# EasyEDA schematic SCH_AIO v4 Std 2024-02-05.json

## Sheets
1 MAIN: TITLE: Sheet_1; REV: 1.0; Date: 2023-03-03; Sheet: 1/1; Drawn By: Richard Klasens; Company: Your Company
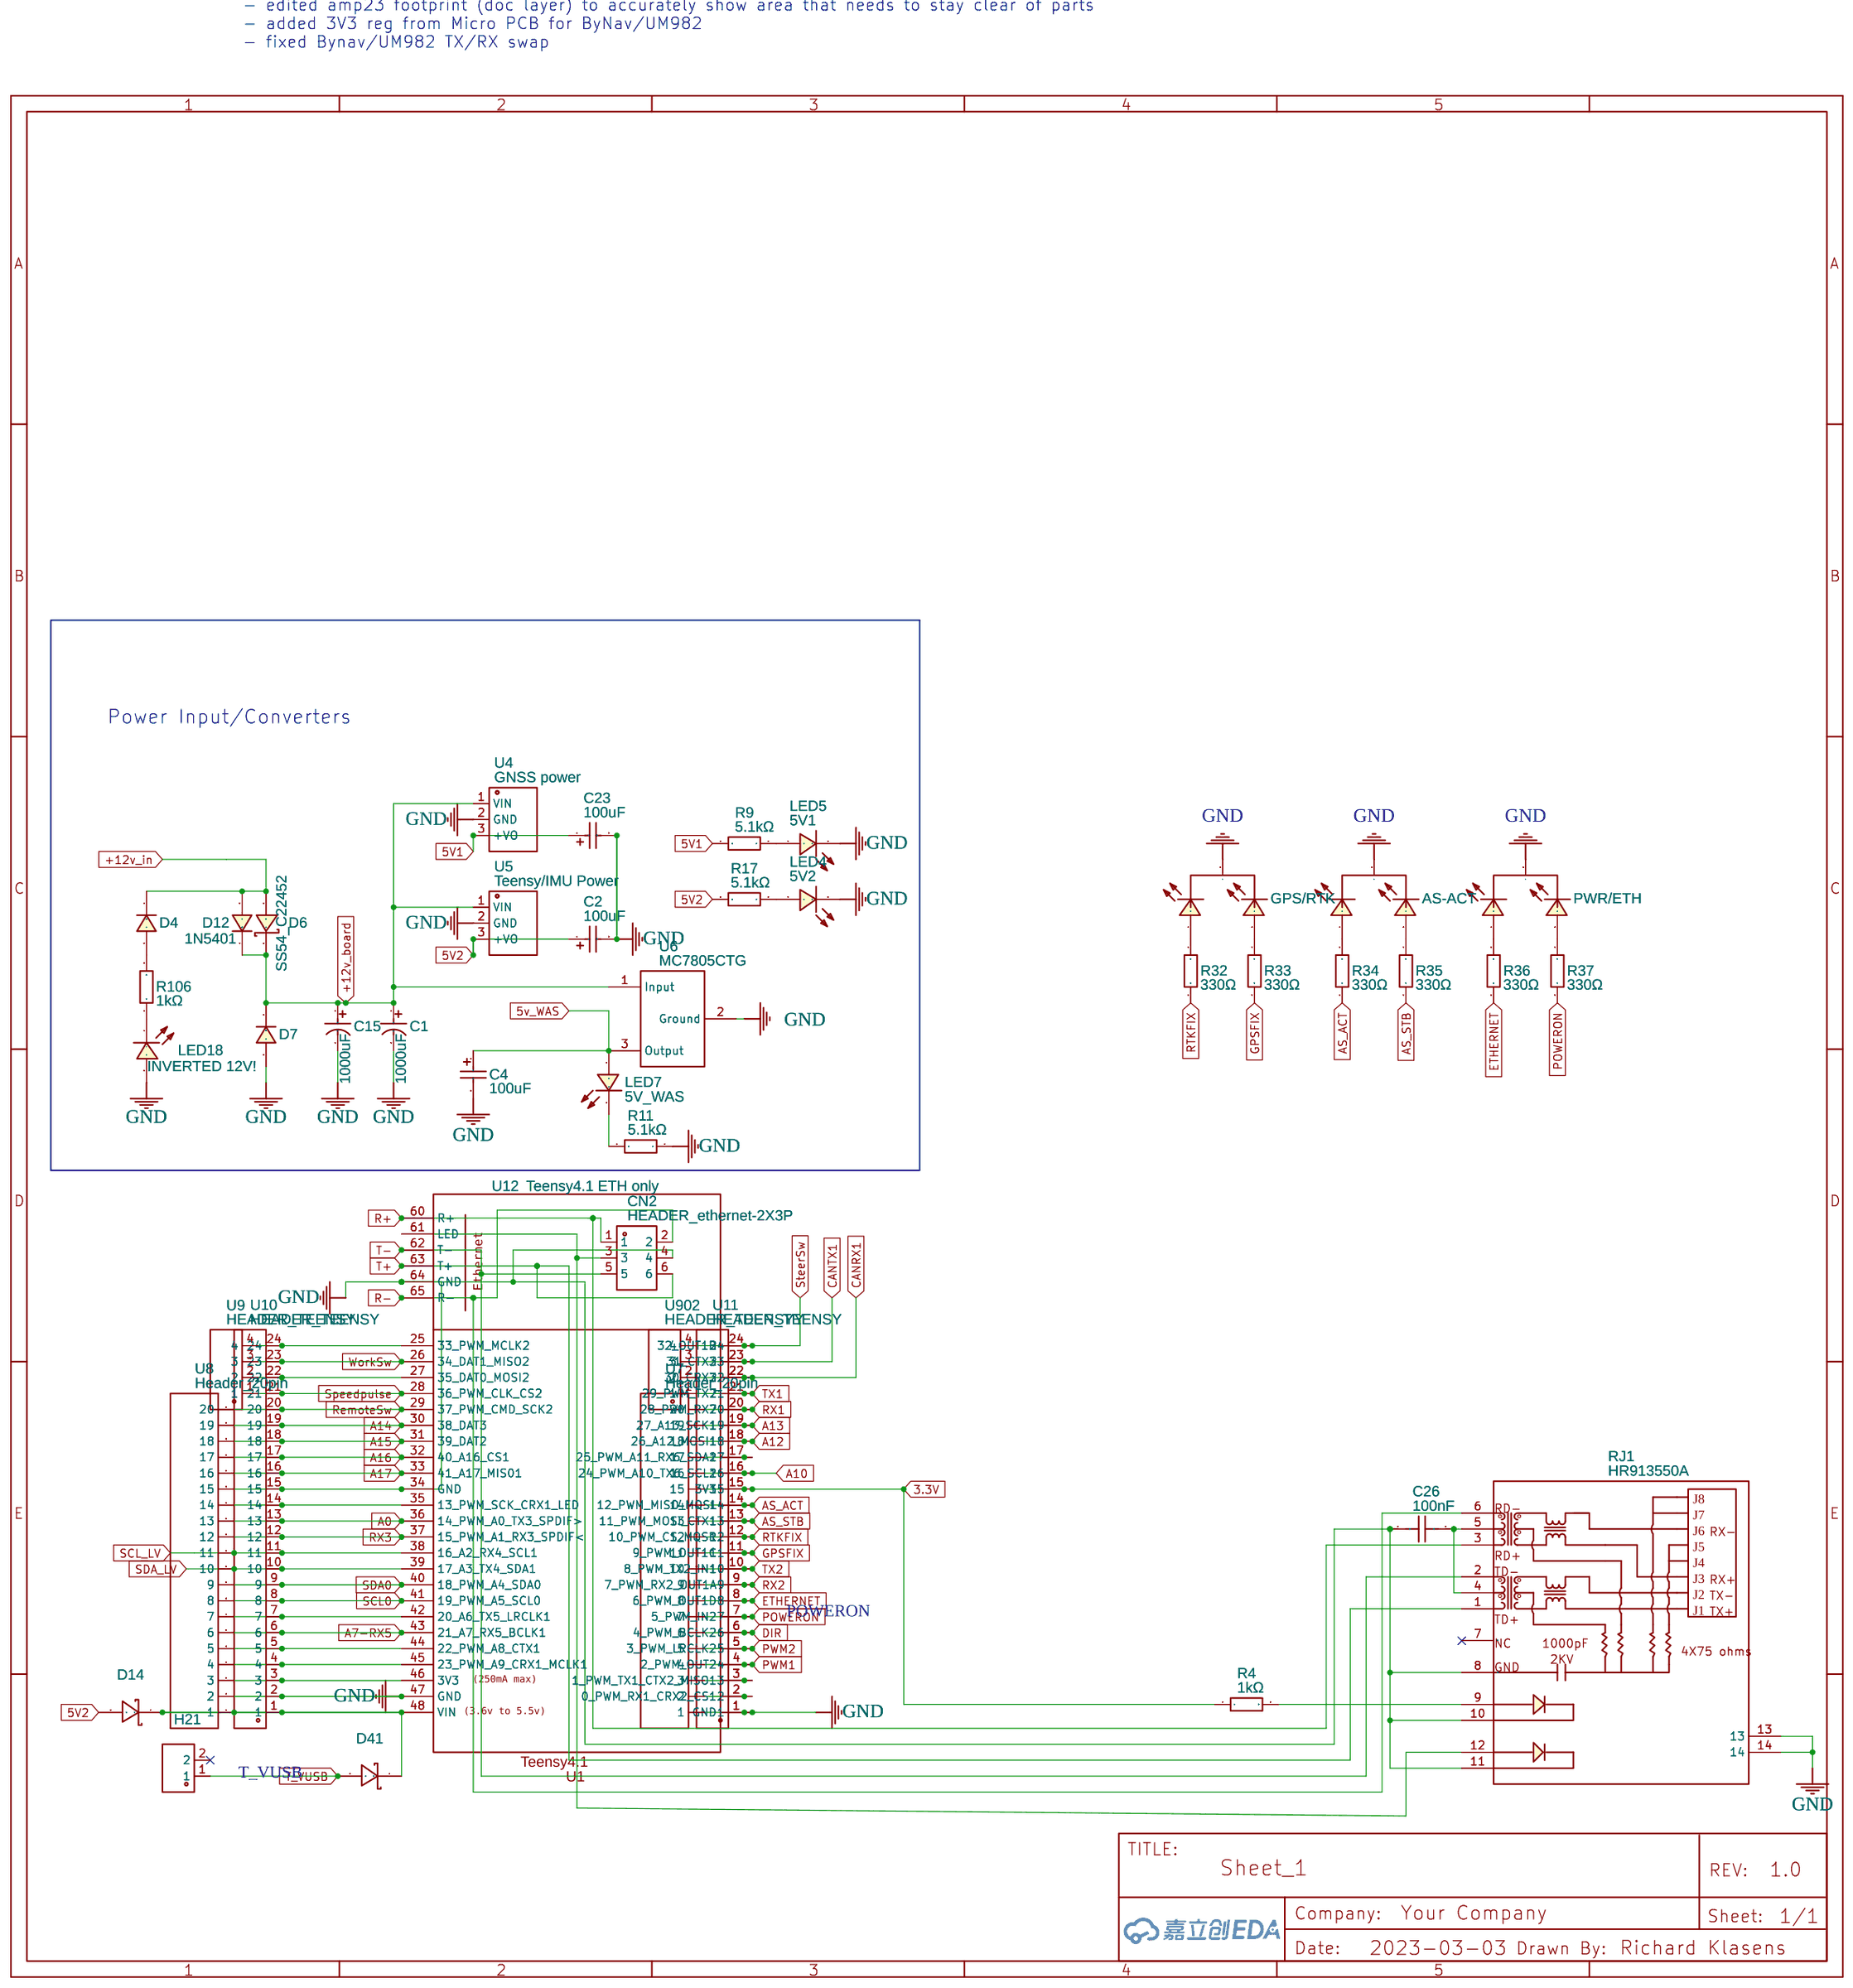
[diagram p0: MAIN]
2 WAS
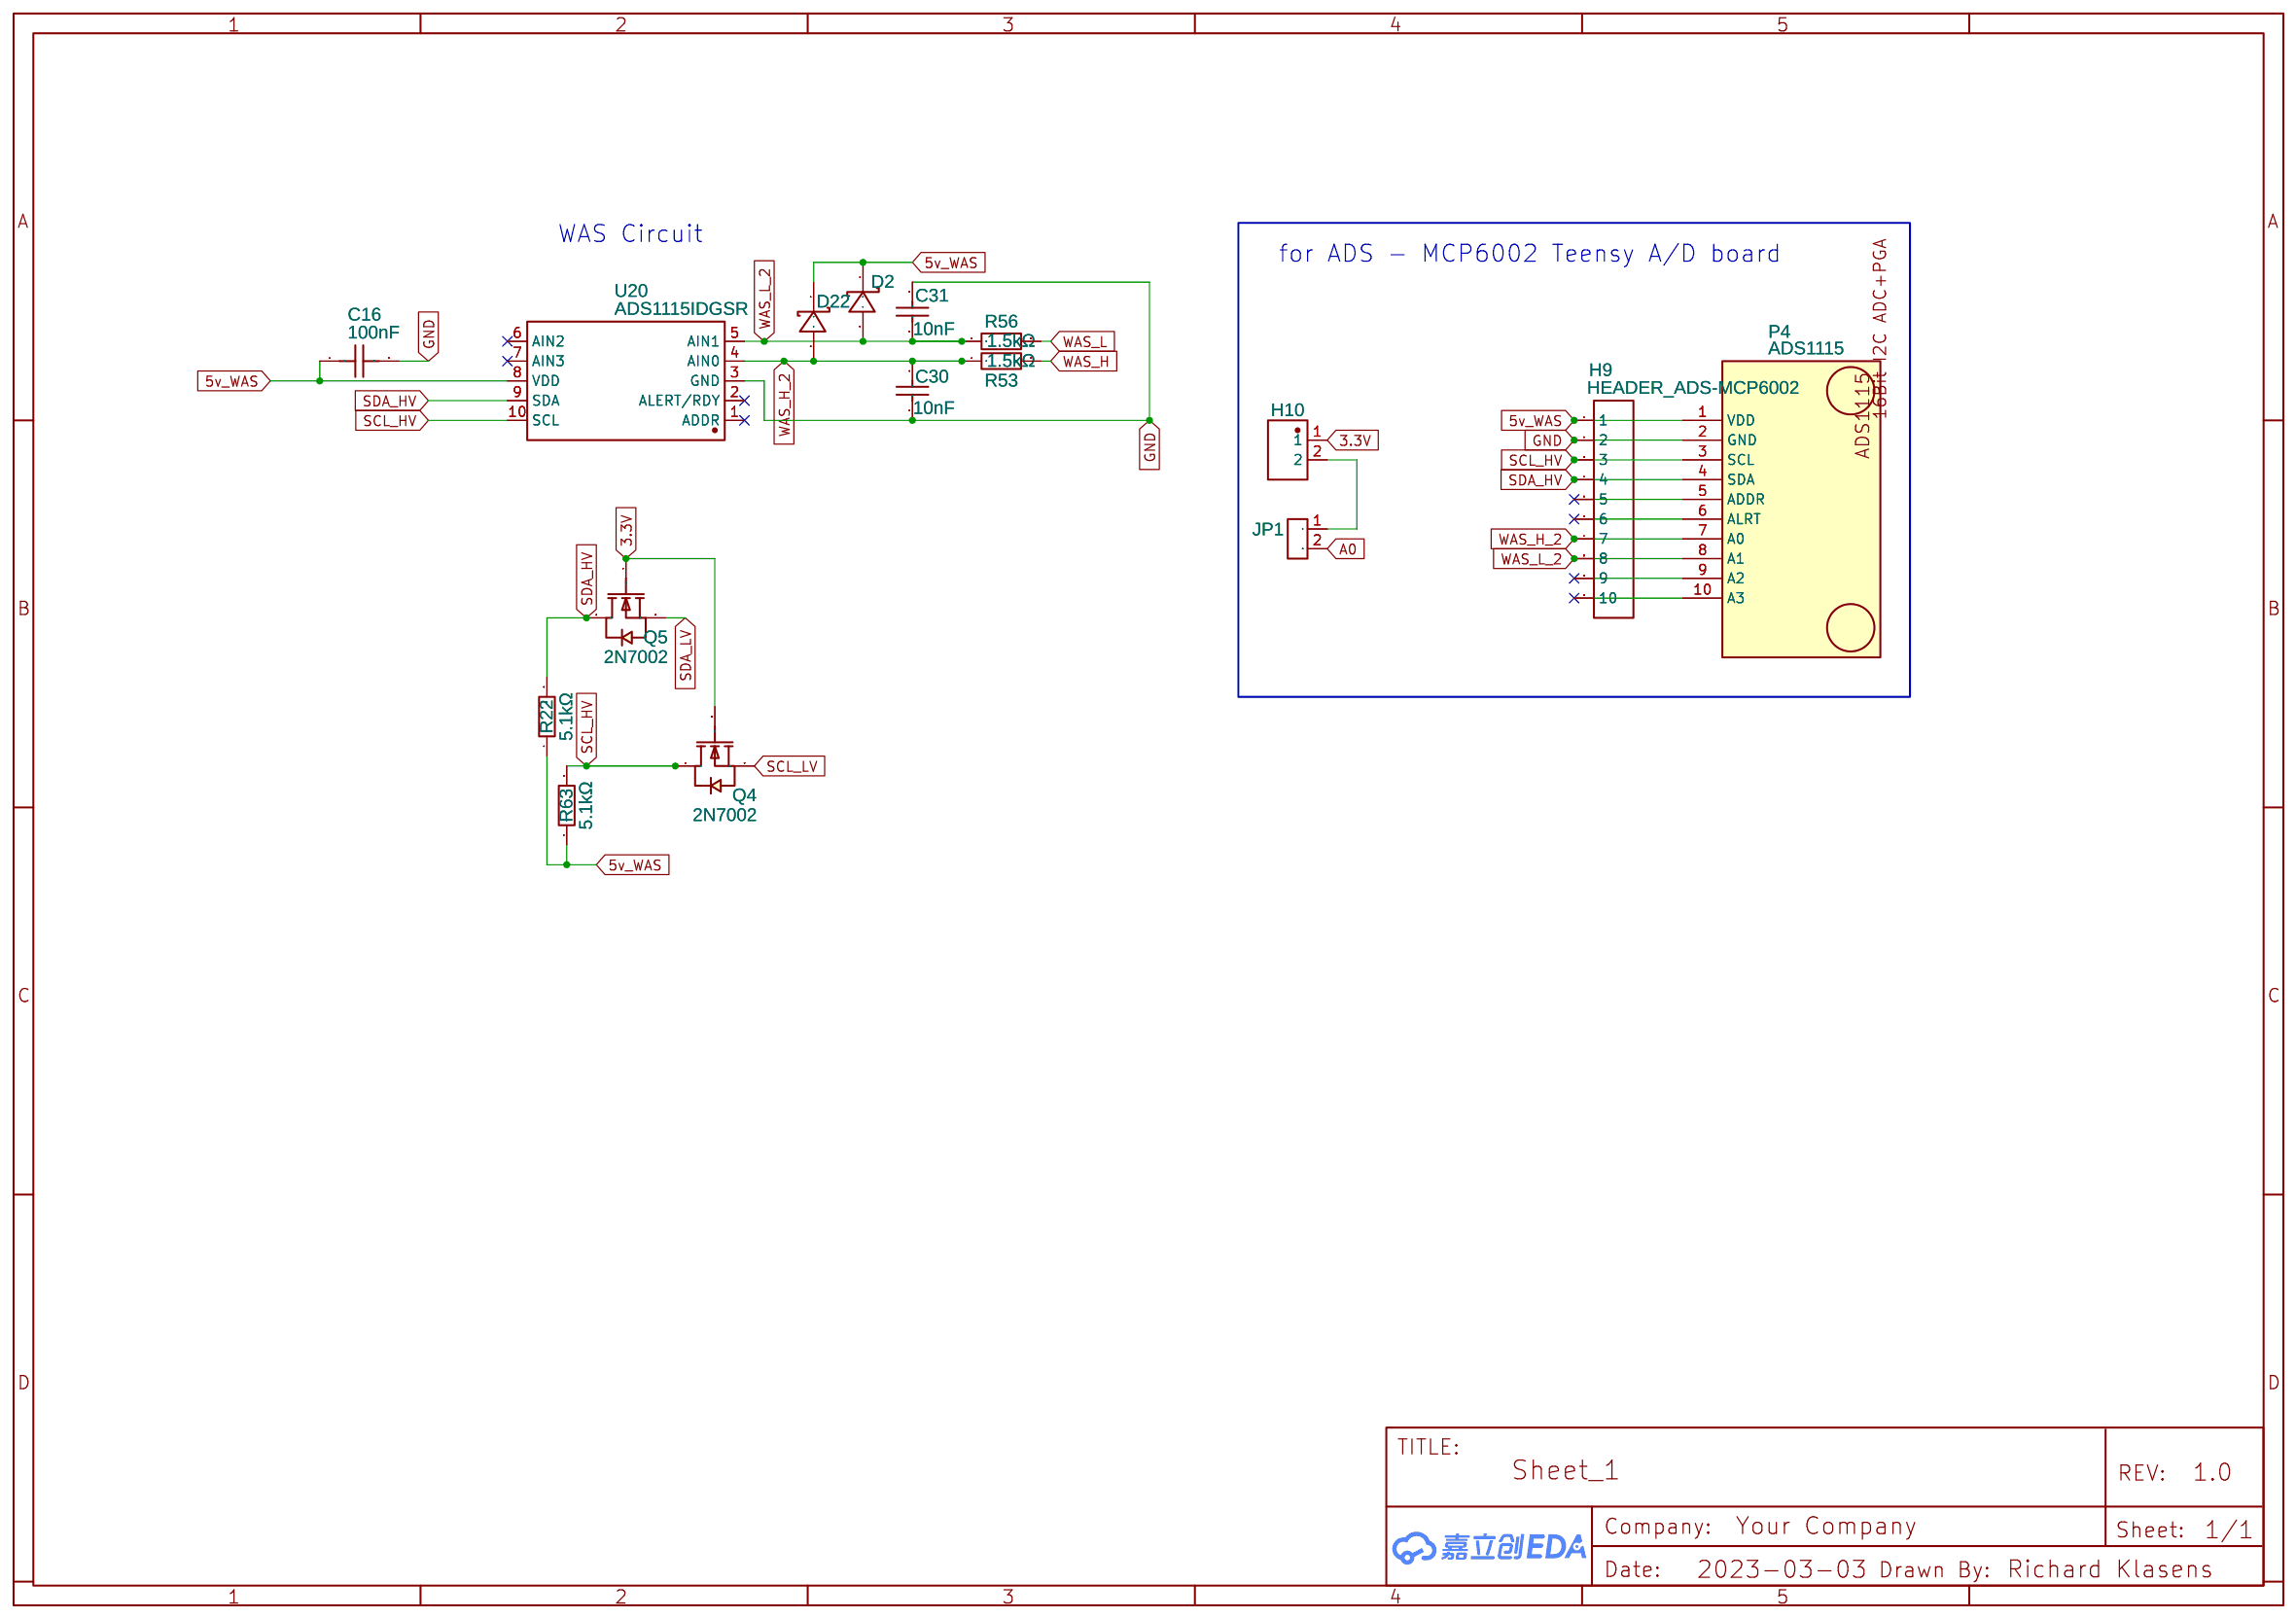
[diagram p1: WAS]
3 STEERING
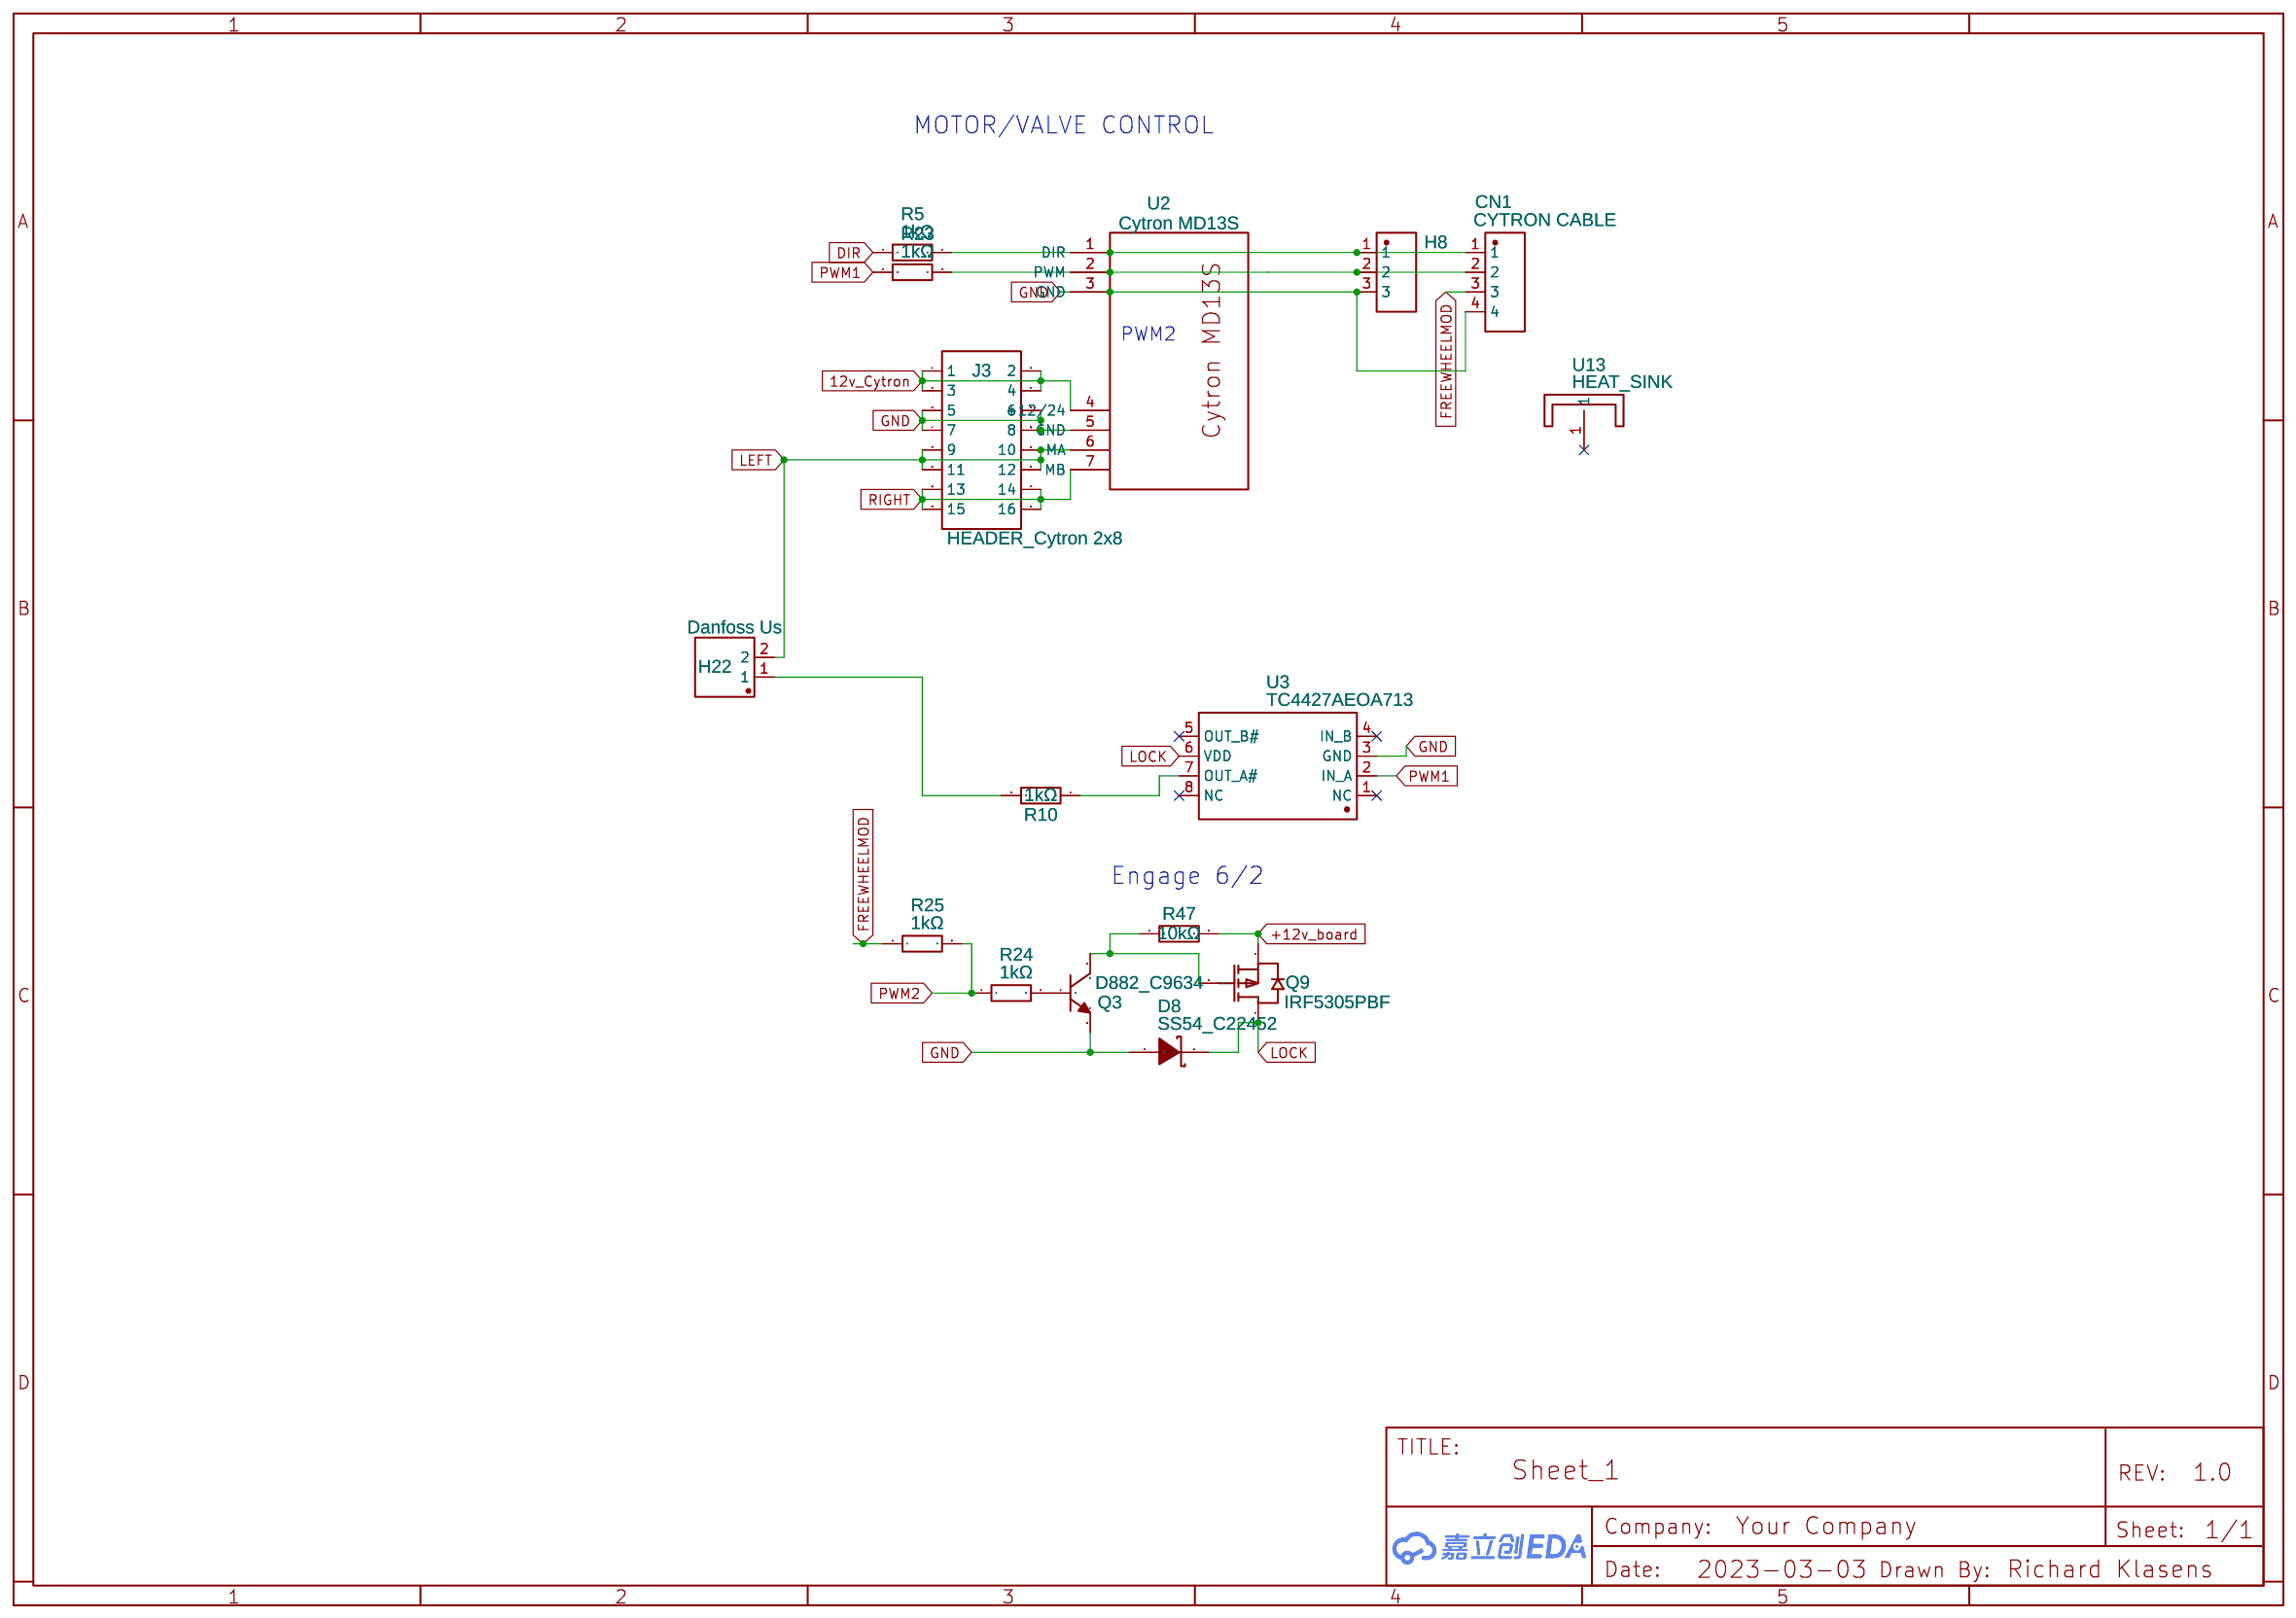
[diagram p2: STEERING]
4 IMU
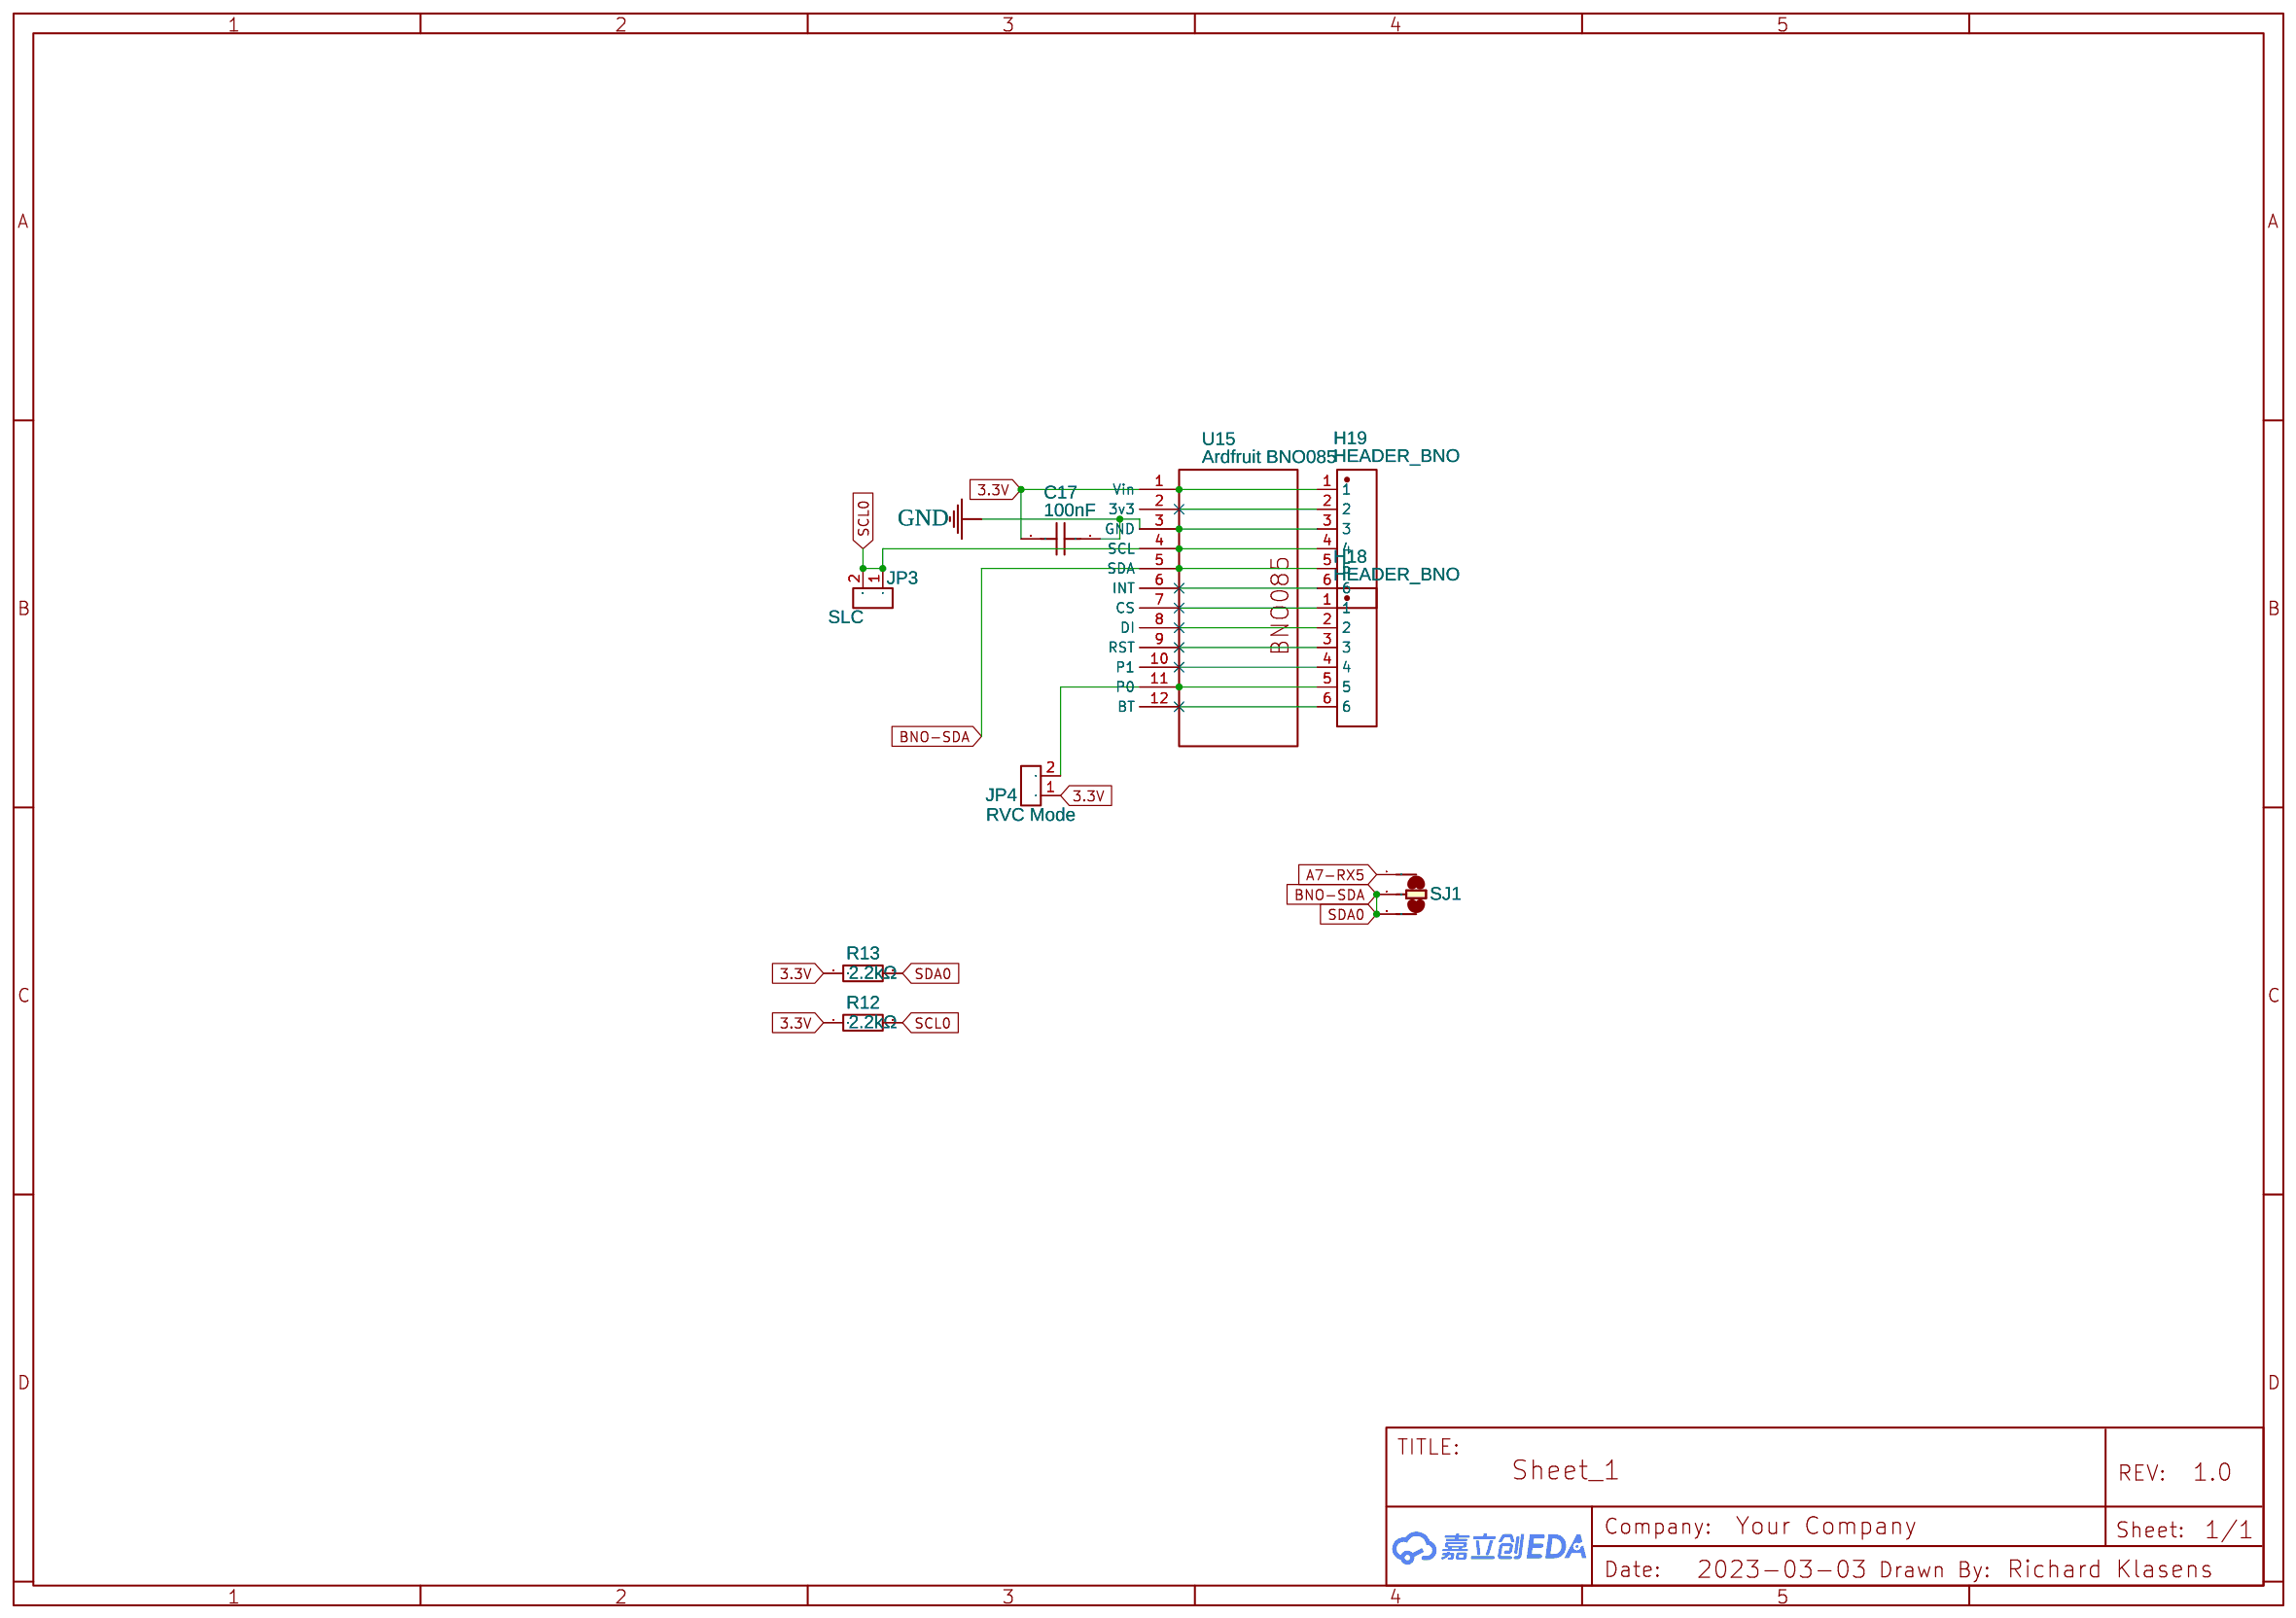
[diagram p3: IMU]
5 GPS
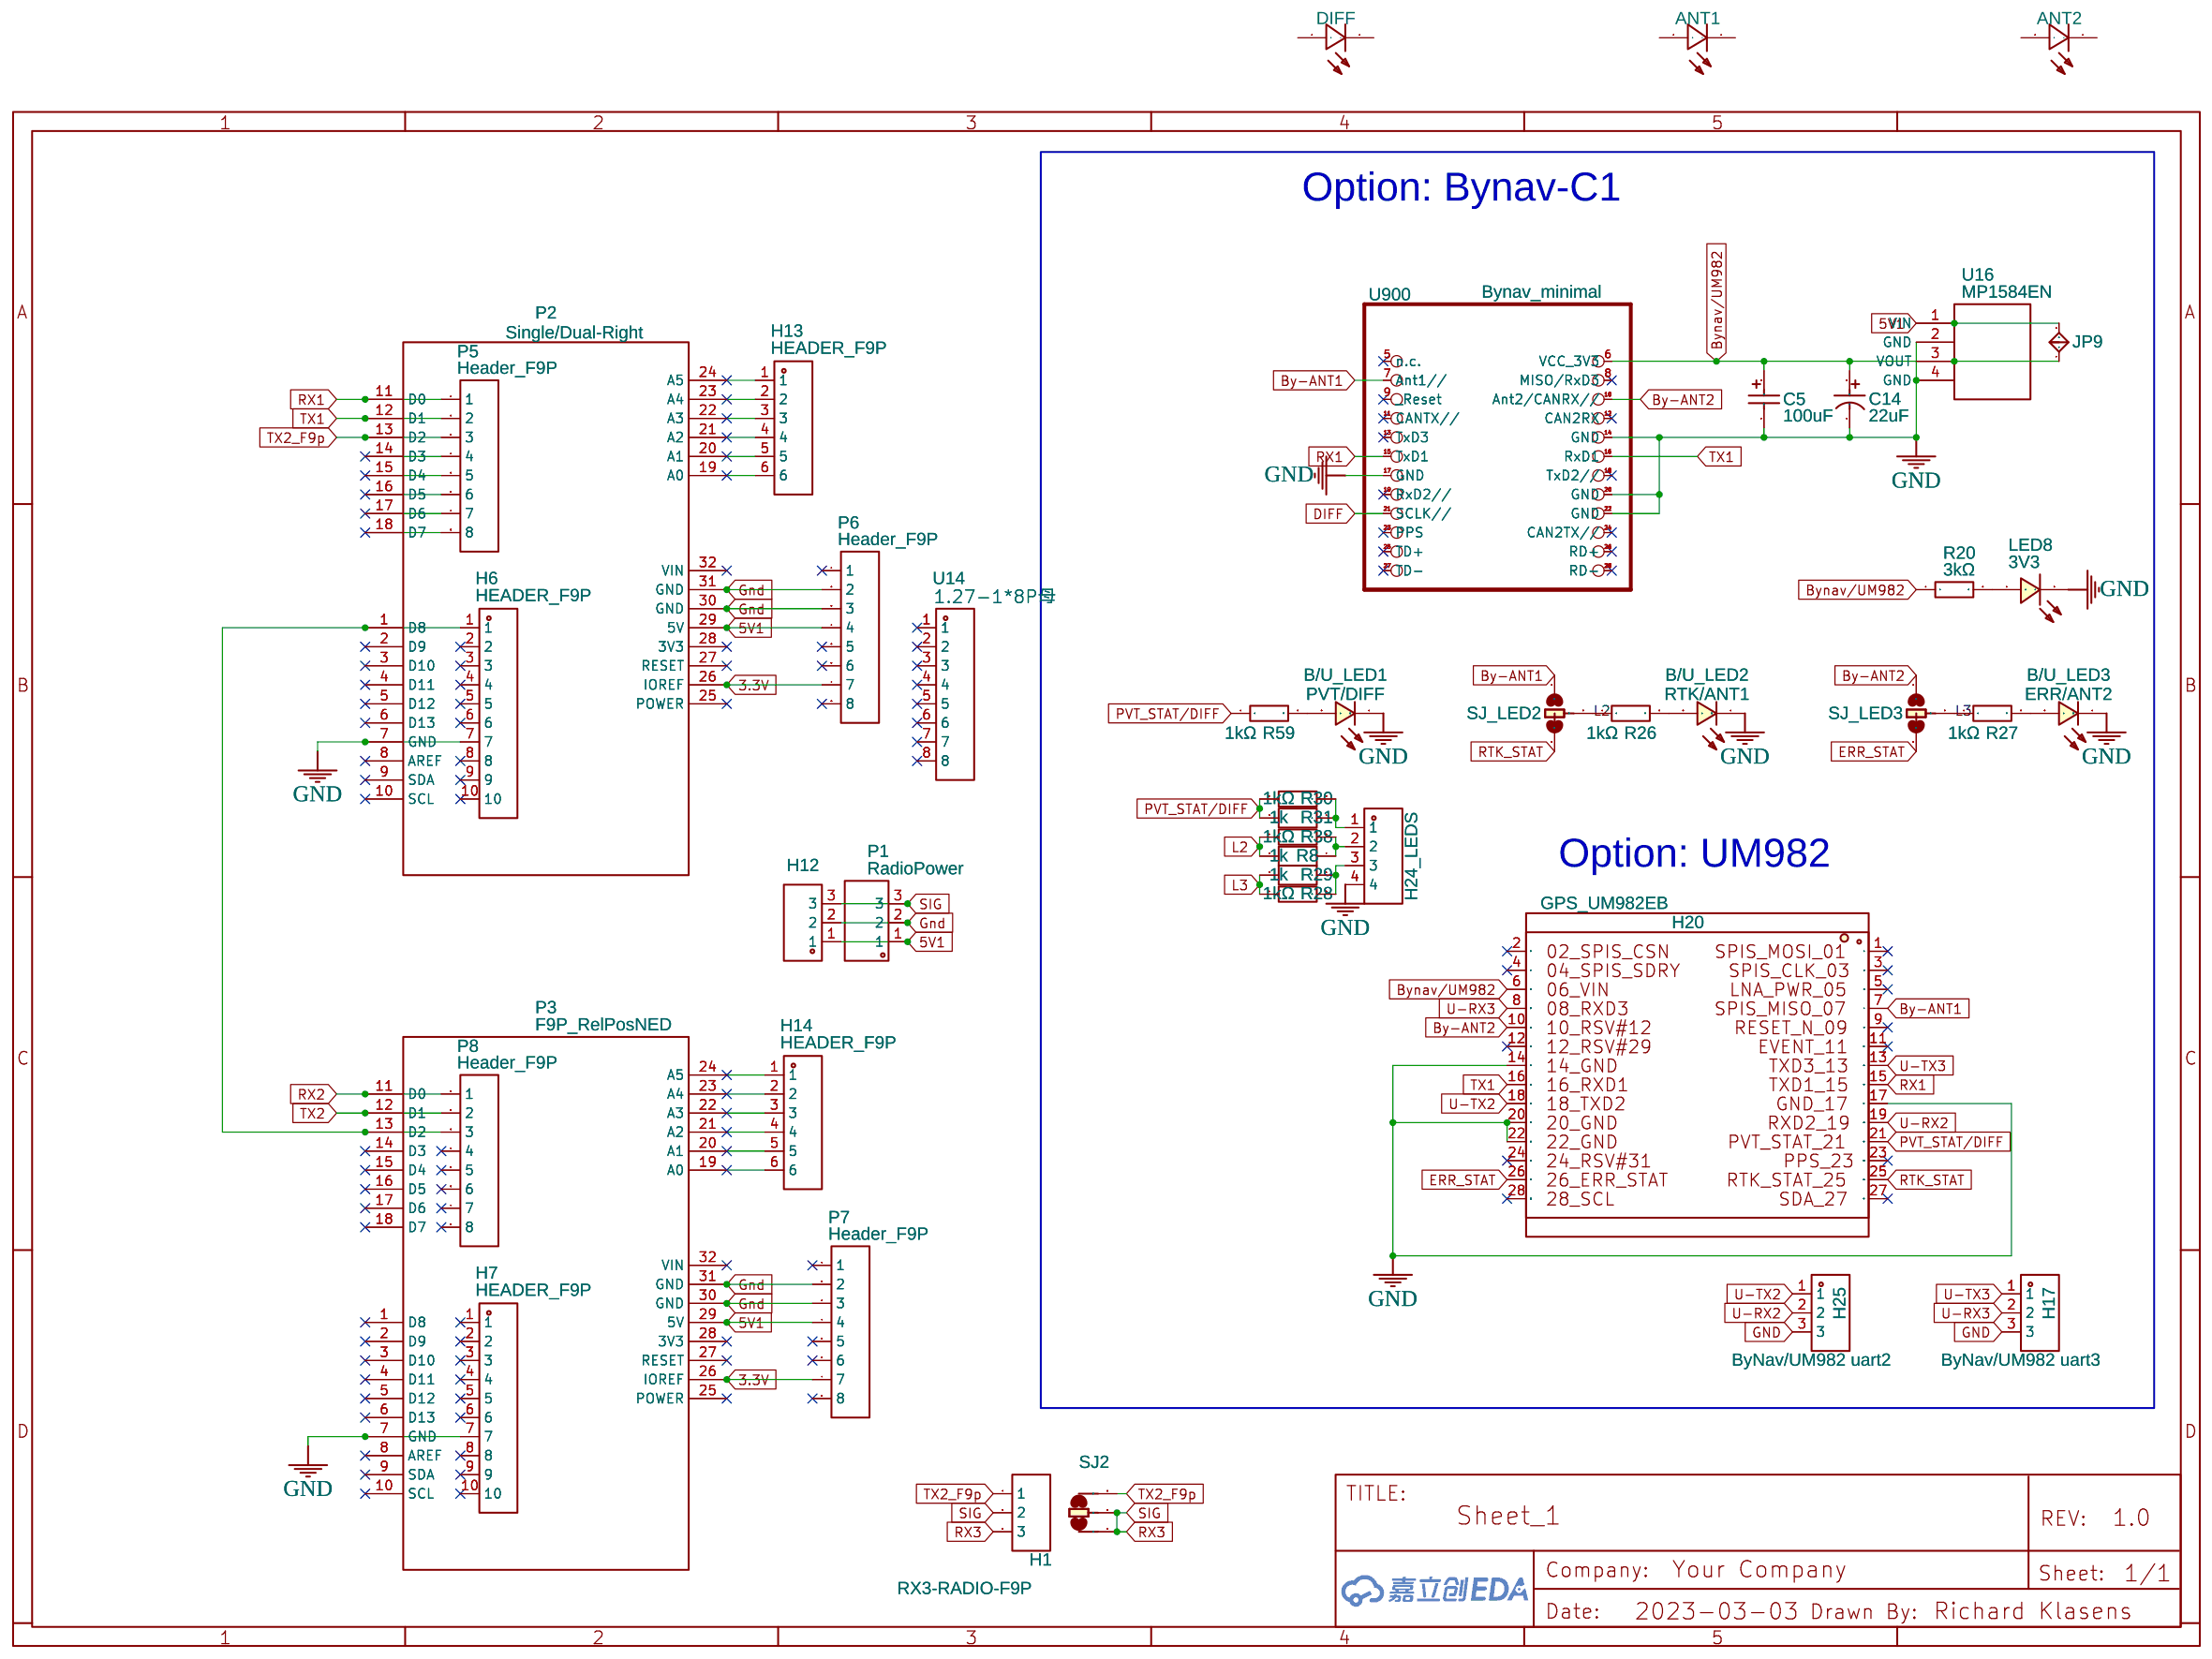
[diagram p4: GPS]
6 INPUTS: TITLE: INPUTS
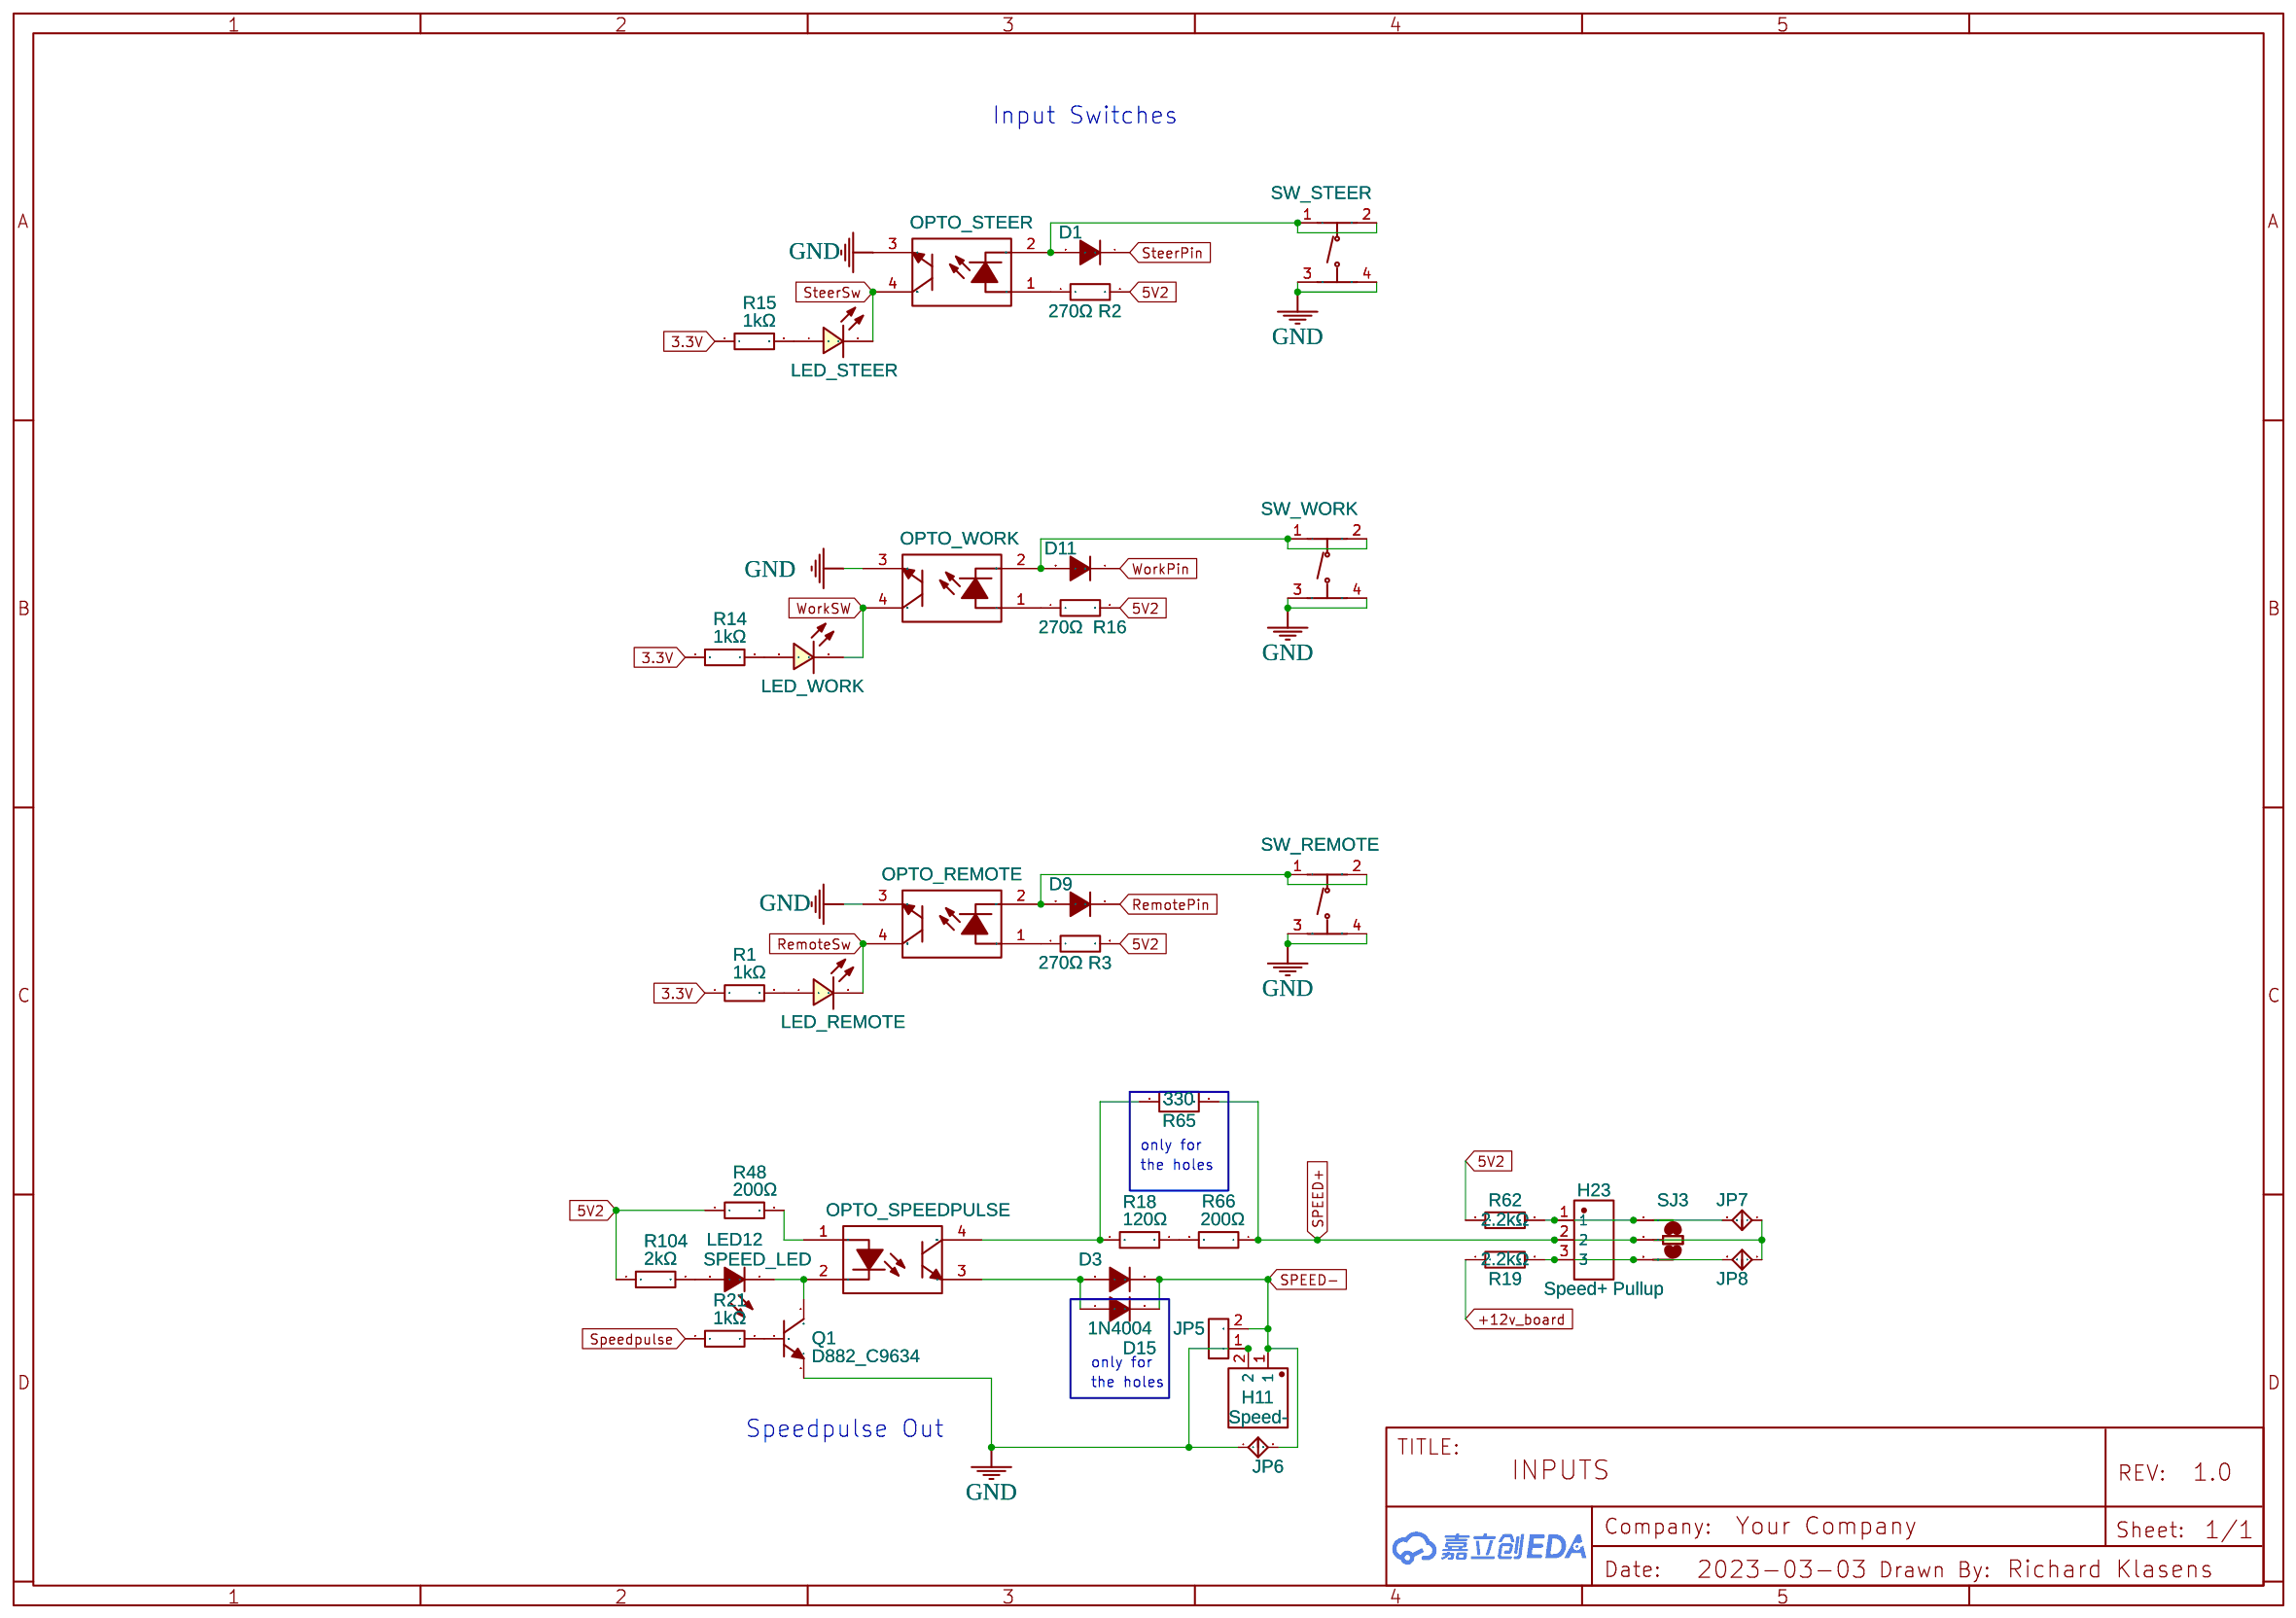
[diagram p5: INPUTS]
7 CONNECTORS
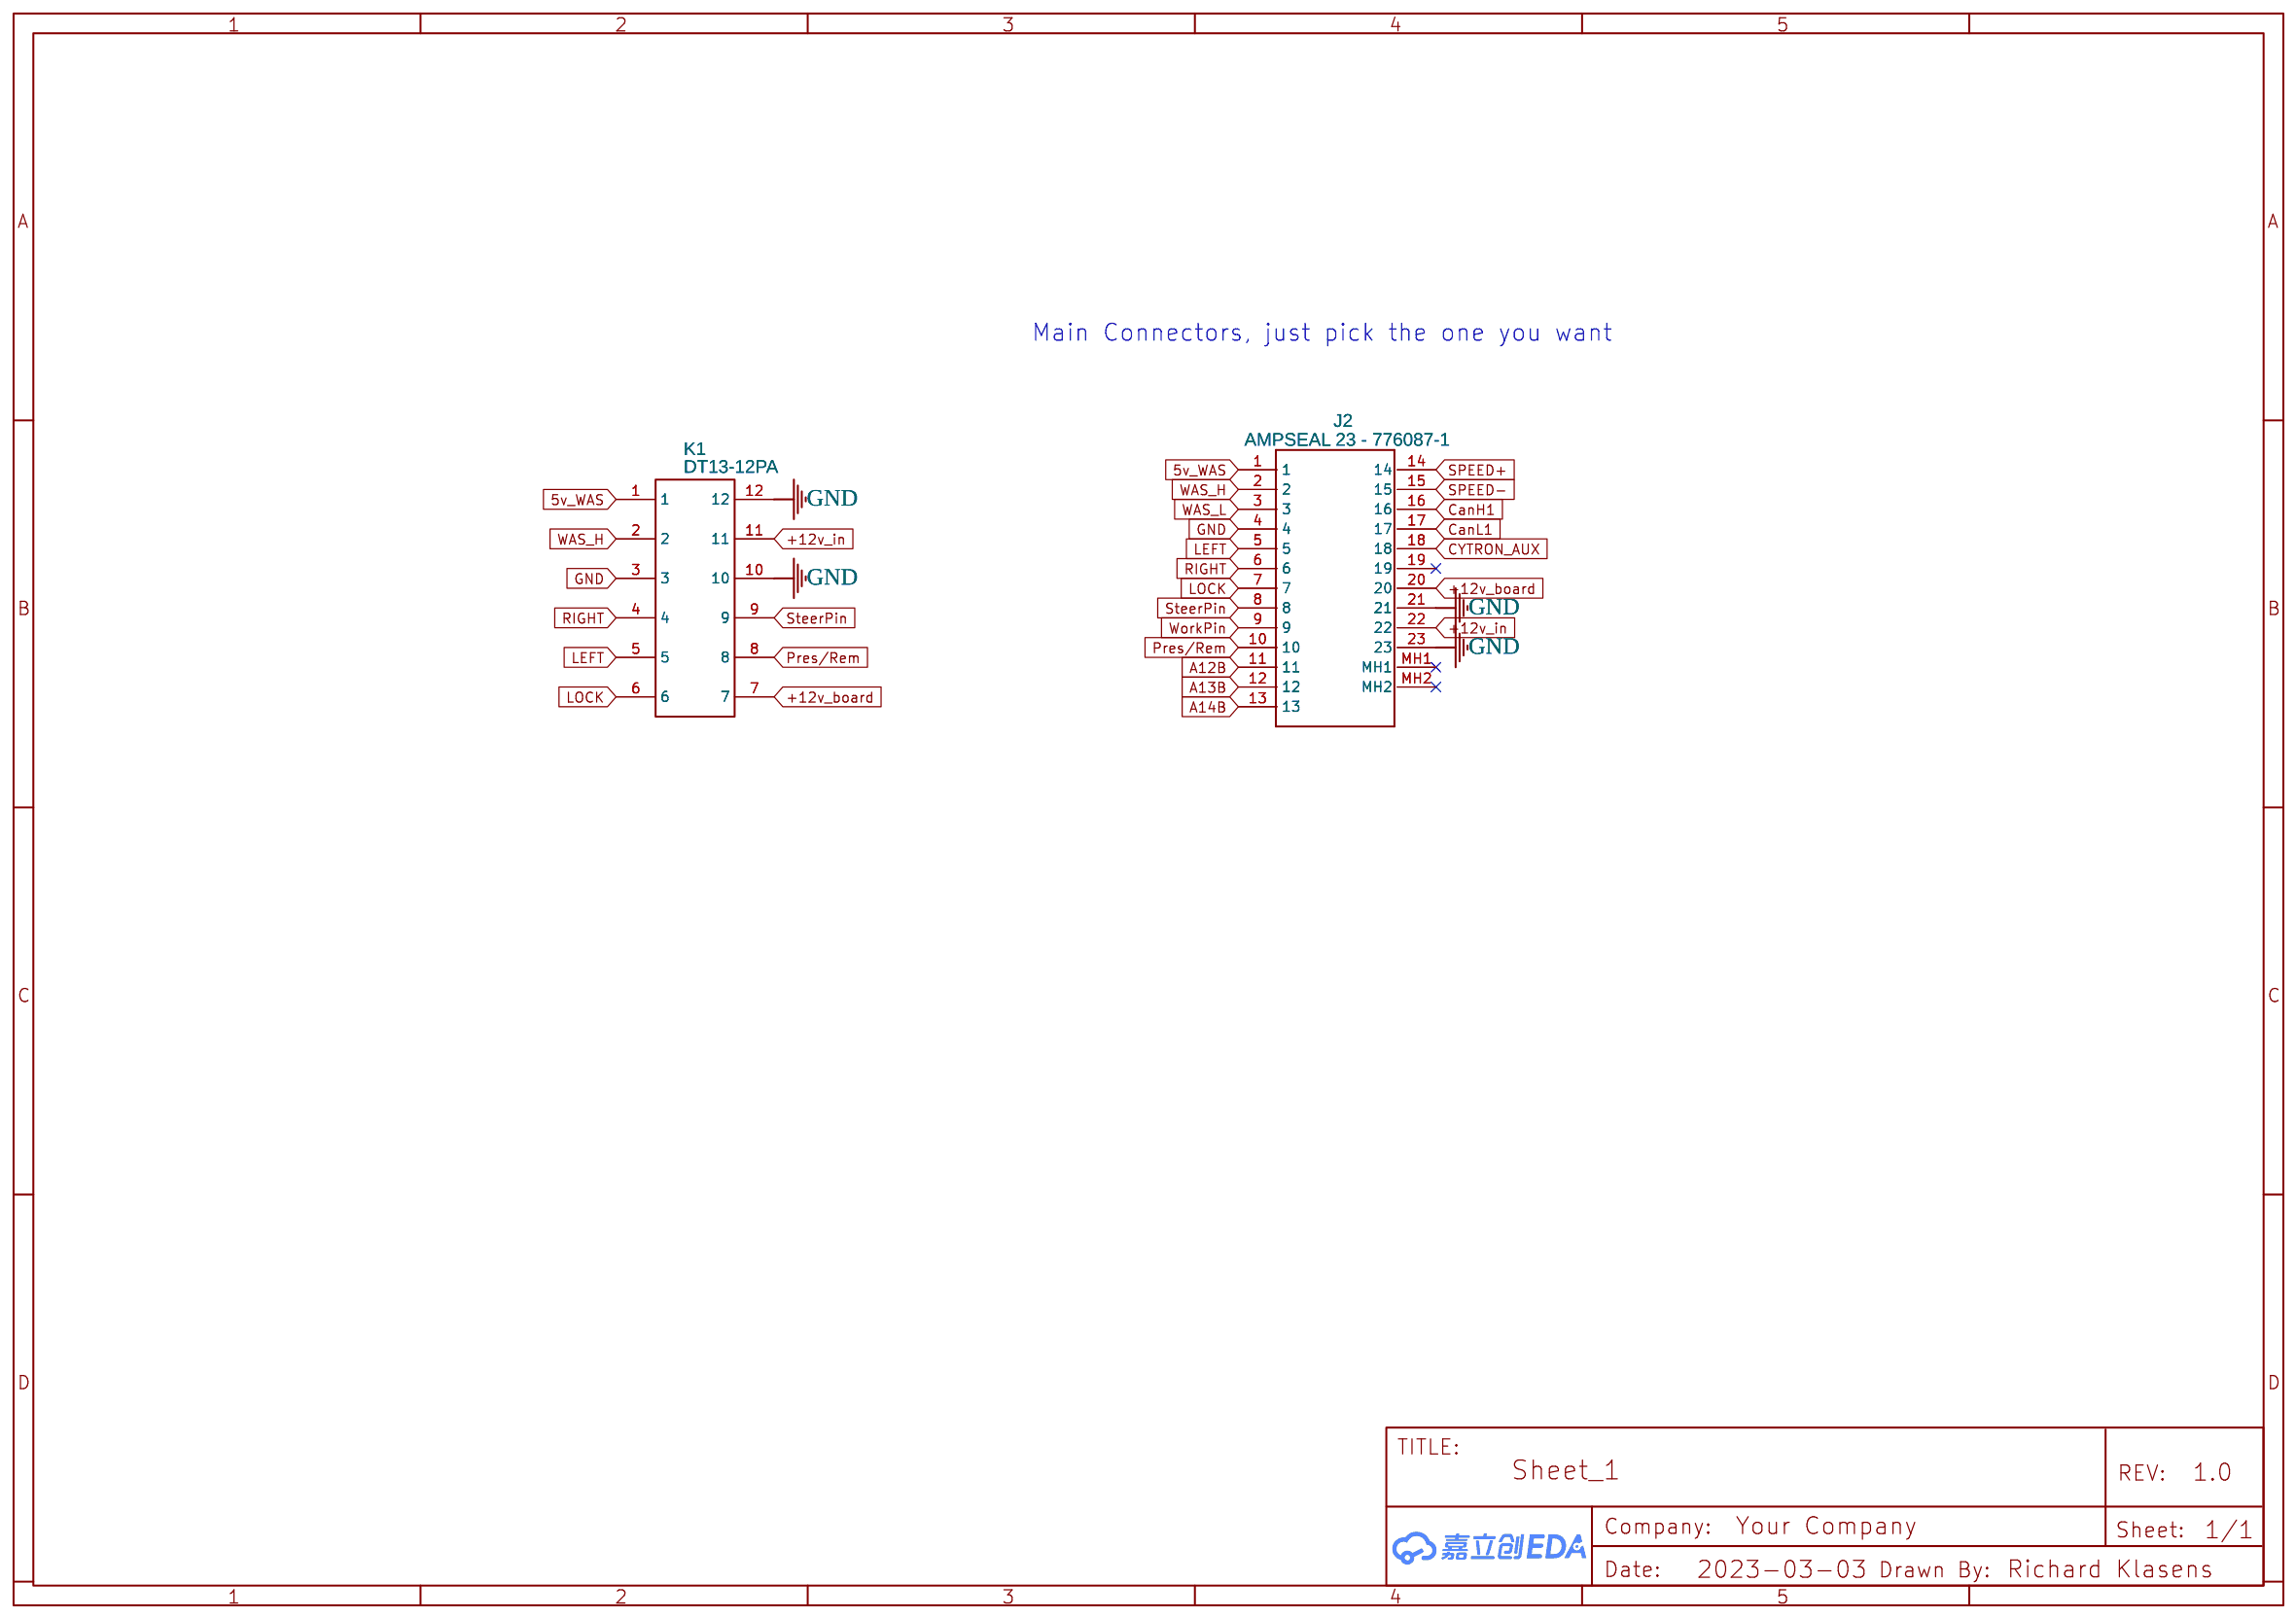
[diagram p6: CONNECTORS]
8 CANBUS
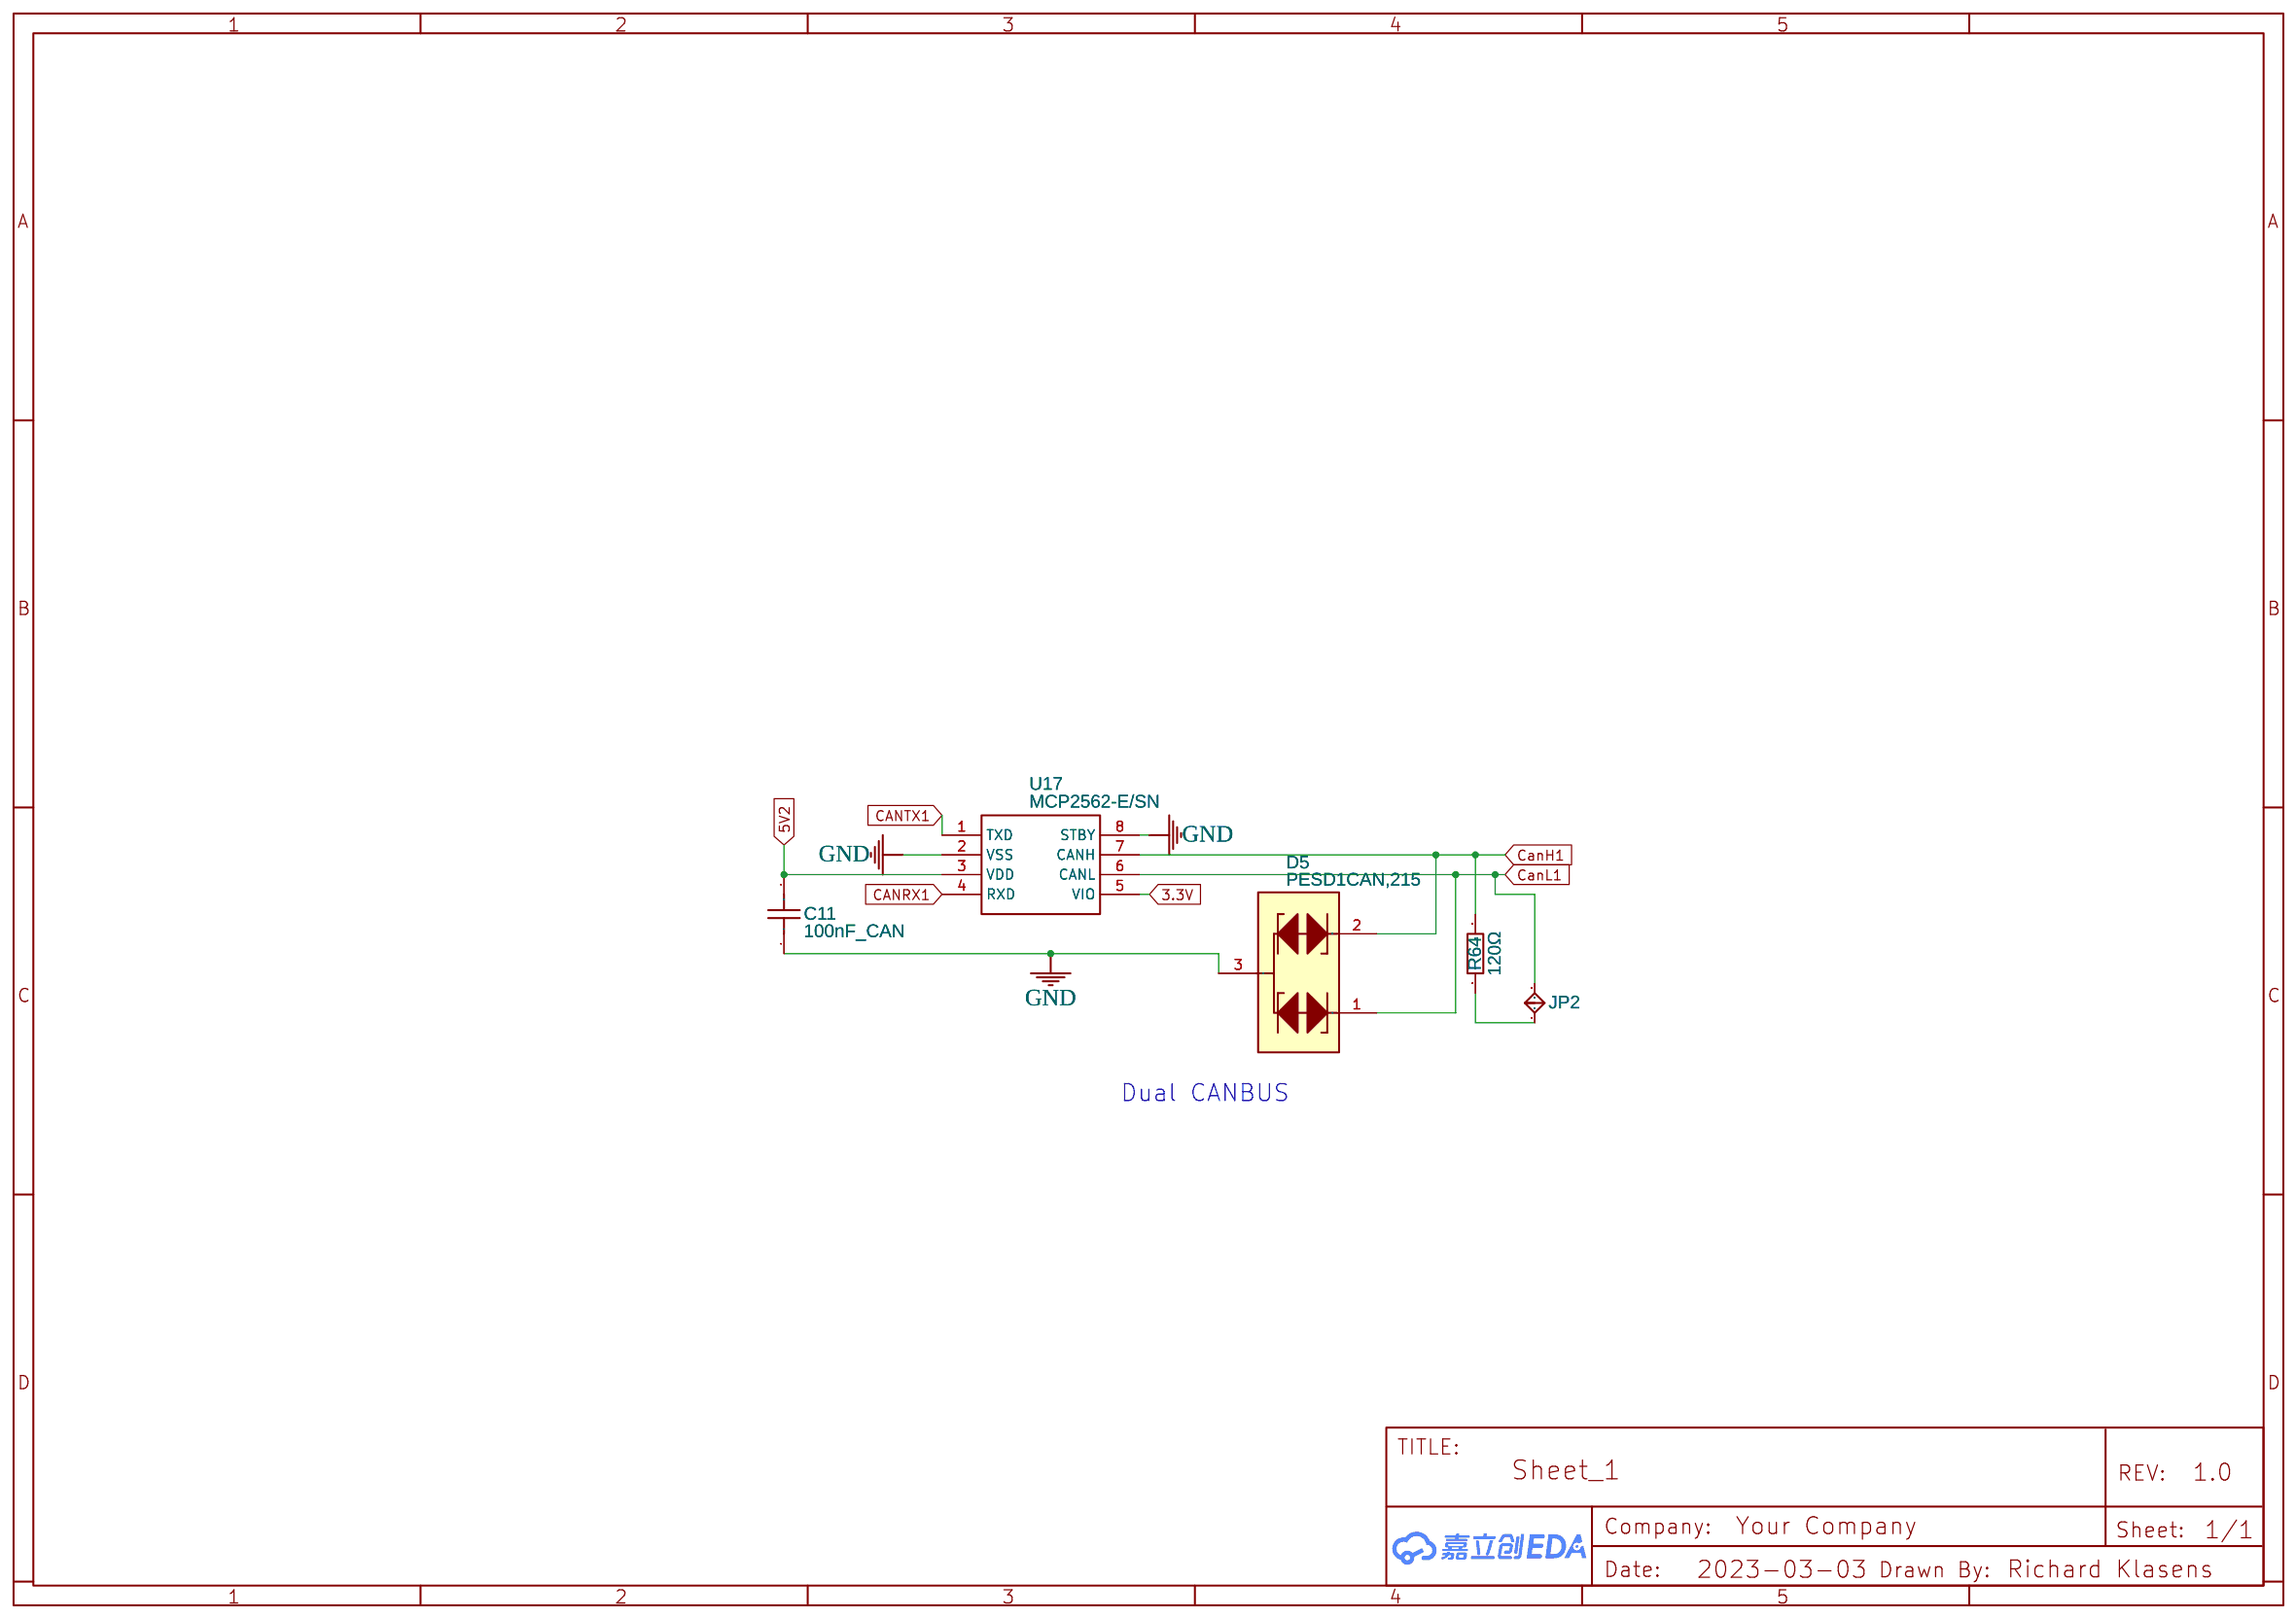
[diagram p7: CANBUS]
9 JUMPERS
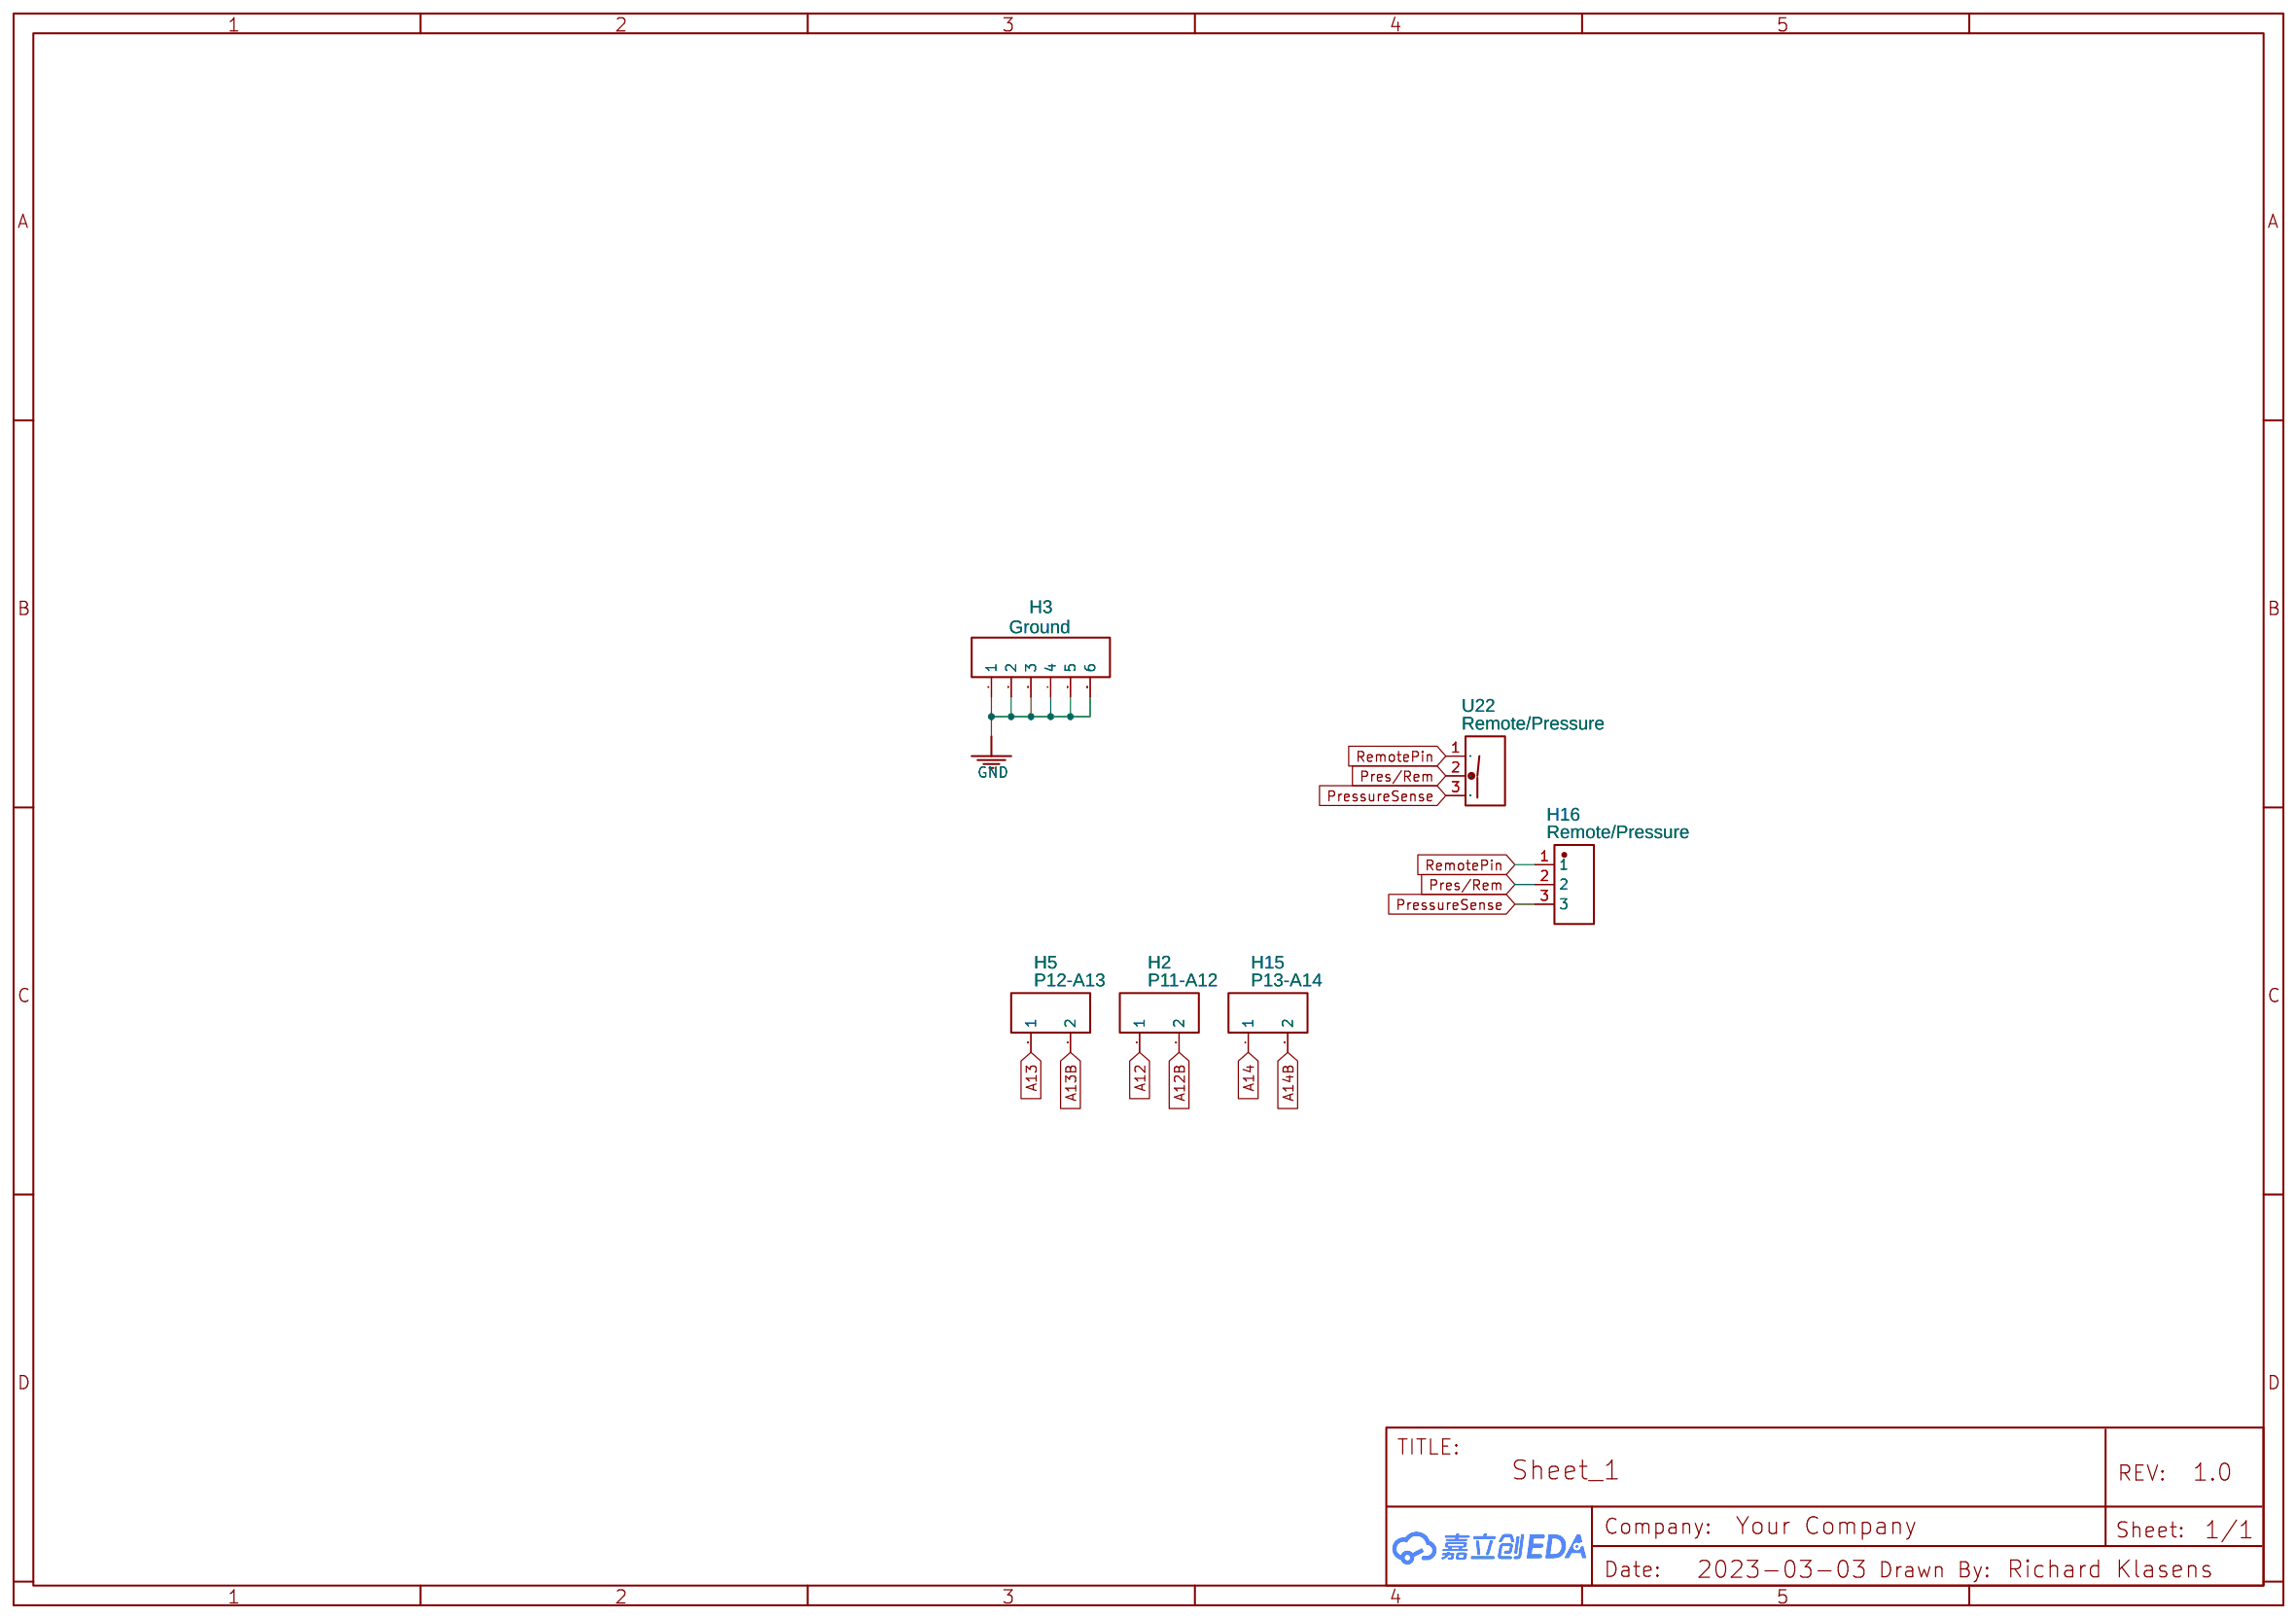
[diagram p8: JUMPERS]
10 SENSORS
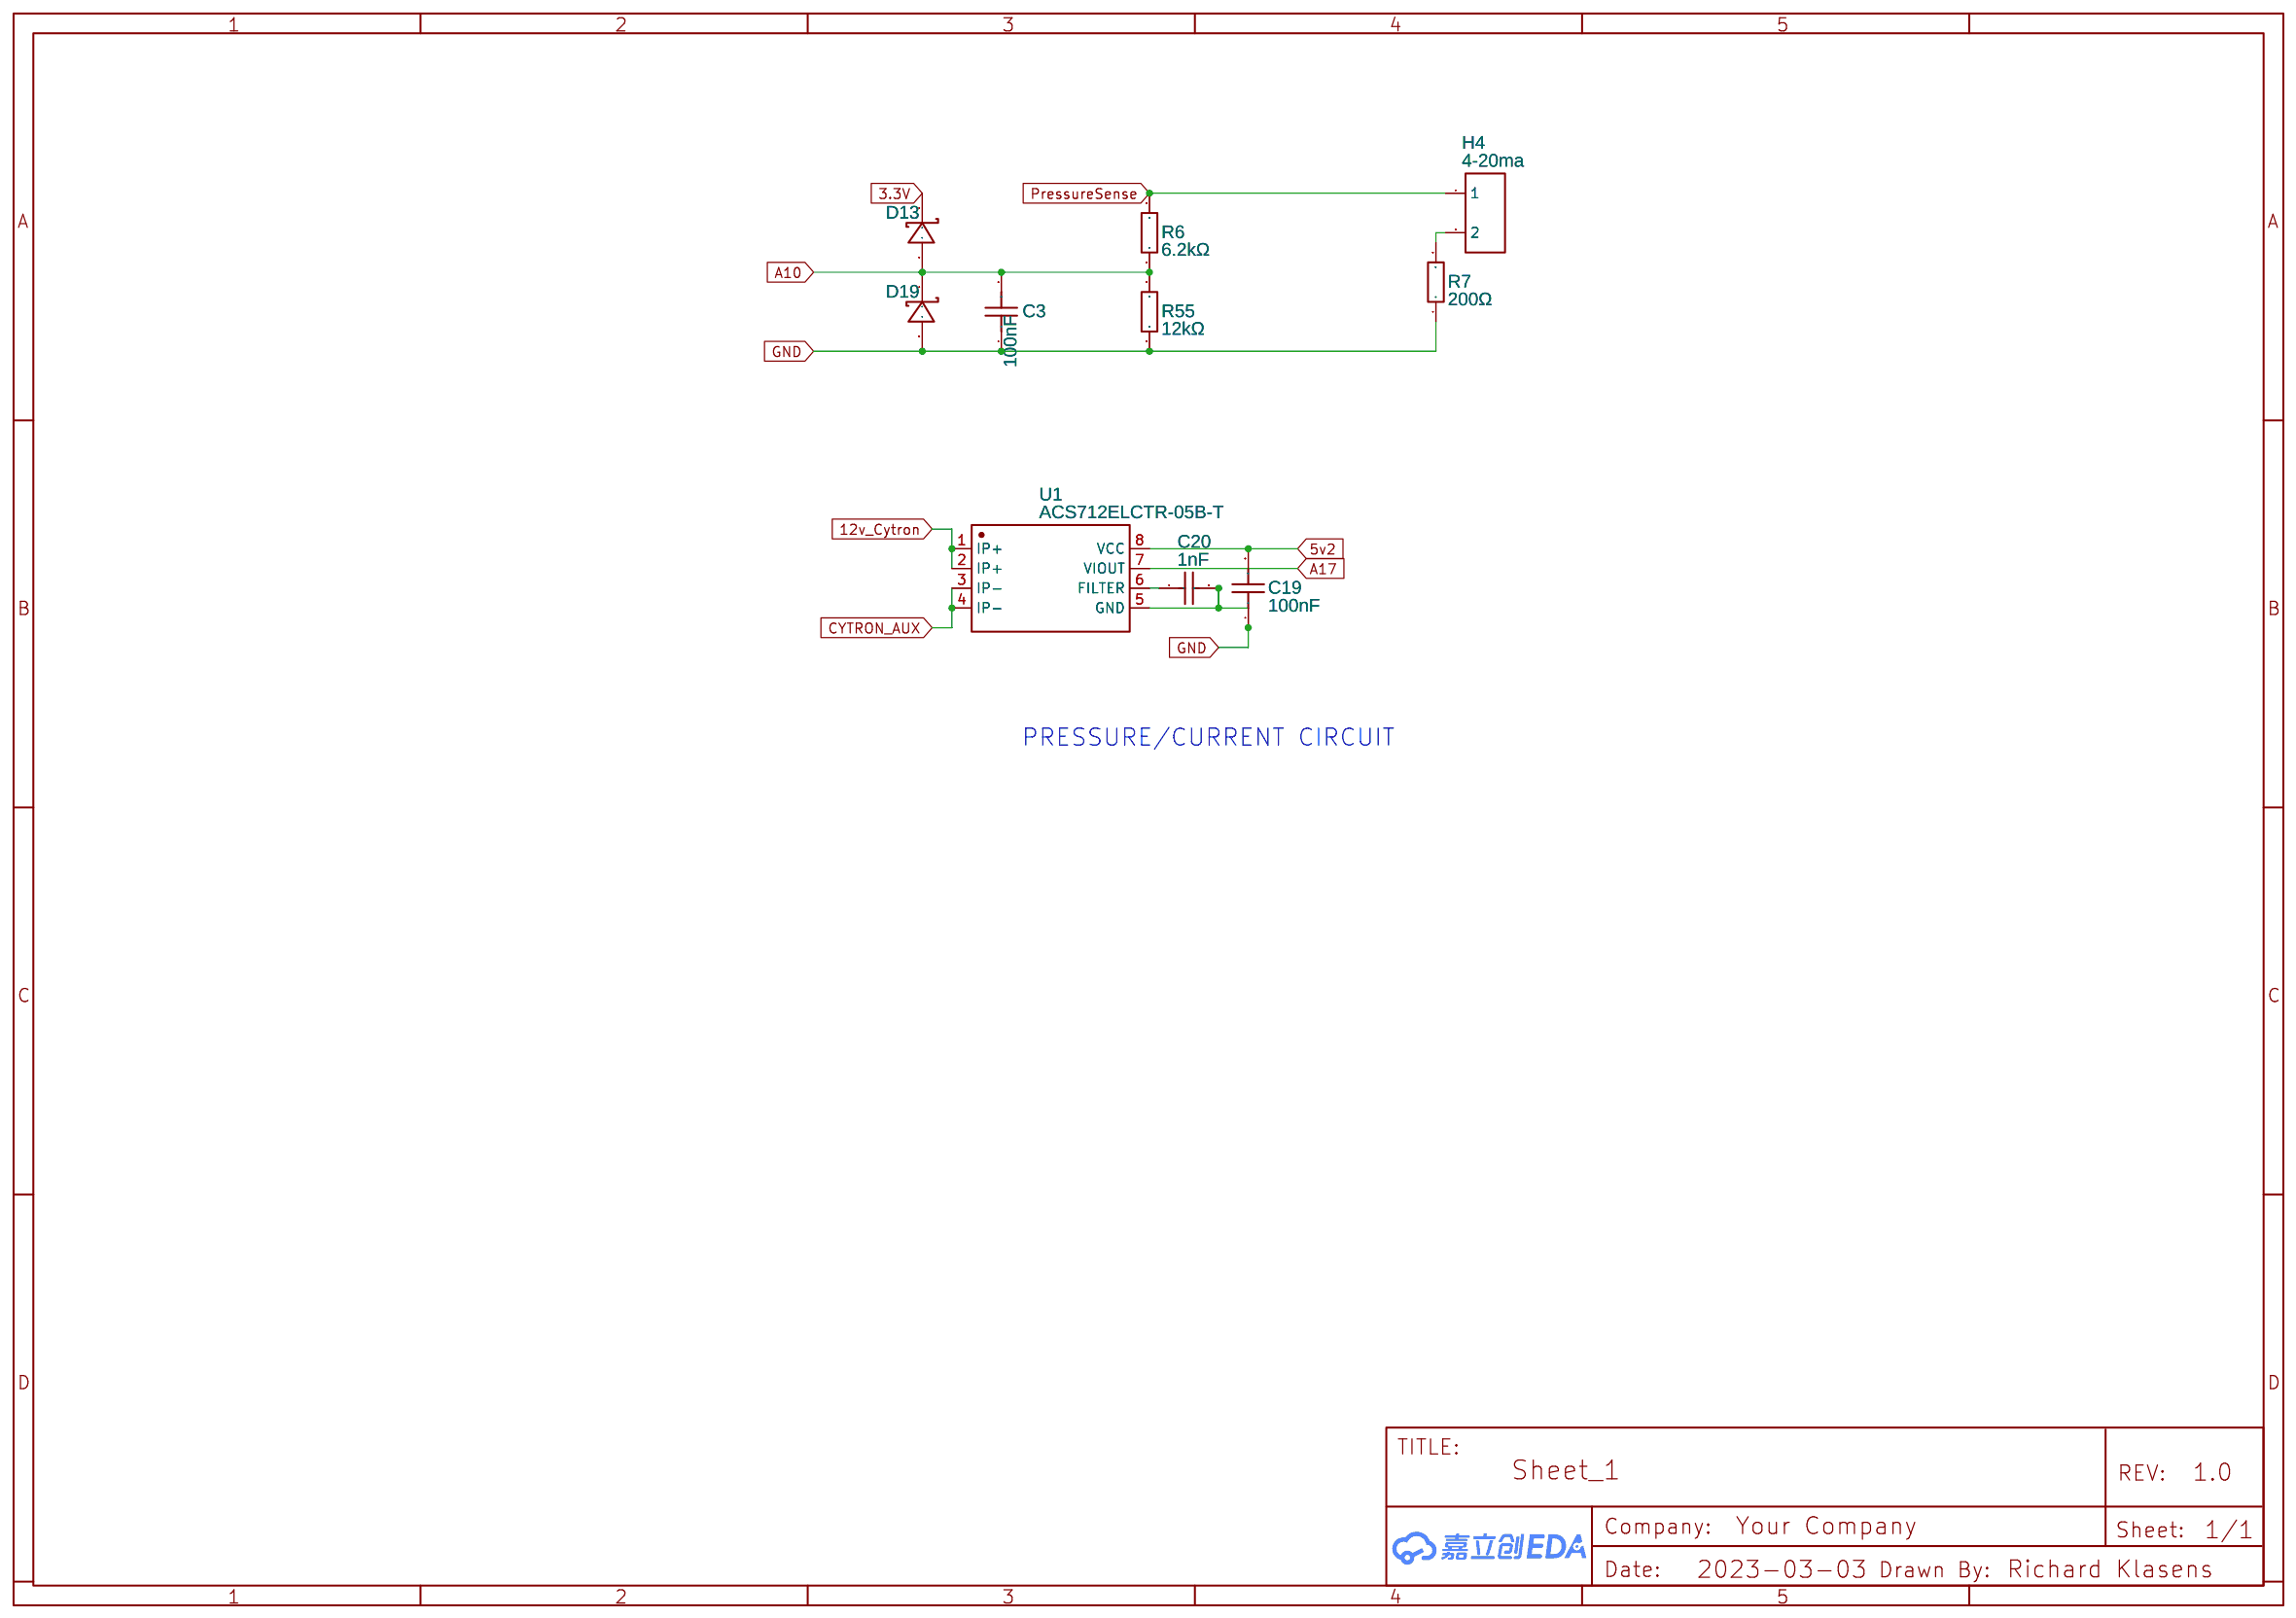
[diagram p9: SENSORS]

## Parts
sheet CANBUS
C11  100nF_CAN  [C0603]
D5  PESD1CAN,215  [SOT-23_L2.9-W1.3-P1.90-LS2.4-BR]
JP2  SPARKFUN-JUMPERS_JUMPER-SMT_2_NC_PASTE_NO-SILK  [SPARKFUN-JUMPERS_SMT-JUMPER_2_NC_PASTE_NO-SILK]
R64  120Ω  [R0805]
U17  MCP2562-E/SN  [SOIC-8_L5.0-W4.0-P1.27-LS6.0-BL]
sheet CONNECTORS
J2  AMPSEAL 23 - 776087-1  [7760871-EXT]
K1  DT13-12PA  [DT13-12PA]
sheet GPS
B/U_LED1  PVT/DIFF  [LED0603-RD COPY - NO SILK]
B/U_LED2  RTK/ANT1  [LED0603-RD COPY - NO SILK]
B/U_LED3  ERR/ANT2  [LED0603-RD COPY - NO SILK]
C5  100uF  [CASE-B_3528]
C14  22uF  [CAP-TH_BD4.0-P1.50-D0.8-FD]
GPS_UM982EB  UM982eb GPS  [UM982-NO-PADS - MIN]
H1  RX3-RADIO-F9P  [HDR-TH_3P-P2.54-V-M-1]
H6  HEADER_F9P  [HDR-TH_10P-P2.54-V-F]
H7  HEADER_F9P  [HDR-TH_10P-P2.54-V-F]
H12  PZ254V-11-03P_C2937625  [HDR-TH_3P-P2.54-V-M]
H13  HEADER_F9P  [HDR-TH_6P-P2.54-V-F]
H14  HEADER_F9P  [HDR-TH_6P-P2.54-V-F]
H17  ByNav/UM982 uart3  [HDR-TH_3P-P2.54-V-M]
H20  2263-214SG0DYNT5 - wide  [HDR-TH_28P-P2.00-V-F-R2-C14-S2.00]
H24_LEDS  Ext LEDs  [HDR-TH_4P-P2.54-V-F-2]
H25  ByNav/UM982 uart2  [HDR-TH_3P-P2.54-V-M]
JP9  UM982 5V  [SPARKFUN-JUMPERS_SMT-JUMPER_2_NC_PASTE_NO-SILK]
LED1  ANT2  [LED-TH_BD5.9-P2.54-RD_GREEN]
LED2  ANT1  [LED-TH_BD5.9-P2.54-RD_GREEN]
LED3  DIFF  [LED-TH_BD5.9-P2.54-RD_GREEN]
LED8  3V3  [LED0805-R-RD]
P1  RadioPower  [KF2510-3A]
P2  Single/Dual-Right  [ARDUSIMPLE_F9P]
P3  F9P_RelPosNED  [ARDUSIMPLE_F9P]
P5  Header_F9P  [HDR-TH_8P-P2.54-V-F-1]
P6  Header_F9P  [HDR-TH_8P-P2.54-V-F-1]
P7  Header_F9P  [HDR-TH_8P-P2.54-V-F-1]
P8  Header_F9P  [HDR-TH_8P-P2.54-V-F-1]
R8  1k  [RES-TH_BD2.4-L6.3-P10.30-D0.6]
R20  3kΩ  [R0603]
R26  1kΩ  [R0402 COPY - NO SILK]
R27  1kΩ  [R0402 COPY - NO SILK]
R28  1kΩ  [R0402 COPY - NO SILK]
R29  1k  [RES-TH_BD2.4-L6.3-P10.30-D0.6]
R30  1kΩ  [R0402 COPY - NO SILK]
R31  1k  [RES-TH_BD2.4-L6.3-P10.30-D0.6]
R38  1kΩ  [R0402 COPY - NO SILK]
R59  1kΩ  [R0402 COPY - NO SILK]
SJ2  JUMPER-PAD-3-NO  [3_SOLDER_JUMPER_LG]
SJ_LED2  SJ_LED1  [PAD-JUMPER-3-2OF3_NC_BY_TRACE_YES]
SJ_LED3  SJ_LED1  [PAD-JUMPER-3-2OF3_NC_BY_TRACE_YES]
U14  1.27-1*8P母  [HDR-TH_8P-P1.27-V-F]
U16  MP1584EN  [MP1584EN]
U900  Bynav_minimal  [BYNAV_C1_MINIMAL]
sheet IMU
C17  100nF  [C0603]
H18  HEADER_BNO  [HDR-TH_6P-P2.54-V-F]
H19  HEADER_BNO  [HDR-TH_6P-P2.54-V-F]
JP3  SLC  [2_SOLDER_JUMPER_LG]
JP4  RVC Mode  [2_SOLDER_JUMPER_LG]
R12  2.2kΩ  [R0805]
R13  2.2kΩ  [R0805]
SJ1  SDA/RX5  [3_SOLDER_JUMPER_LG]
U15  Ardfruit BNO085  [ADAFRUIT-BNO085]
sheet INPUTS
D1  SM4007PL  [SOD-123F_L2.8-W1.8-LS3.7-RD]
D3  SM4007PL  [SOD-123F_L2.8-W1.8-LS3.7-RD]
D9  SM4007PL  [SOD-123F_L2.8-W1.8-LS3.7-RD]
D11  SM4007PL  [SOD-123F_L2.8-W1.8-LS3.7-RD]
D15  1N4004  [DO-41_BD2.4-L4.7-P8.70-D0.9-FD]
H11  Speed-  [HDR-TH_2P-P2.54-V-M-1]
H23  Speed+ Pullup  [HDR-TH_3P-P2.54-V-M]
JP5  RVC Mode  [2_SOLDER_JUMPER_LG]
JP6  SPARKFUN-JUMPERS_JUMPER-SMT_2_NC_PASTE_NO-SILK  [SPARKFUN-JUMPERS_SMT-JUMPER_2_NC_PASTE_NO-SILK]
JP7  SPARKFUN-JUMPERS_JUMPER-SMT_2_NC_PASTE_NO-SILK  [SPARKFUN-JUMPERS_SMT-JUMPER_2_NC_PASTE_NO-SILK]
JP8  SPARKFUN-JUMPERS_JUMPER-SMT_2_NC_PASTE_NO-SILK  [SPARKFUN-JUMPERS_SMT-JUMPER_2_NC_PASTE_NO-SILK]
LED12  SPEED_LED  [LED0603-RD]
LED_REMOTE  Remote  [LED0603-R-RD_WHITE]
LED_STEER  Steer  [LED0603-R-RD_WHITE]
LED_WORK  Work  [LED0603-R-RD_WHITE]
OPTO_REMOTE  Remote  [SOP-4_L4.4-W2.8-P1.27-LS7.0-TL]
OPTO_SPEEDPULSE  Speed Pulse  [SOP-4_L4.4-W2.8-P1.27-LS7.0-TL]
OPTO_STEER  Steer  [SOP-4_L4.4-W2.8-P1.27-LS7.0-TL]
OPTO_WORK  Work  [SOP-4_L4.4-W2.8-P1.27-LS7.0-TL]
Q1  D882_C9634  [SOT-89-3_L4.5-W2.5-P1.50-LS4.2-BR]
R1  1kΩ  [R0603 COPY - NO SILK]
R2  270Ω  [R0603]
R3  270Ω  [R0603]
R14  1kΩ  [R0603 COPY - NO SILK]
R15  1kΩ  [R0603 COPY - NO SILK]
R16  270Ω  [R0603]
R18  120Ω  [R0805]
R19  2.2kΩ  [R0805]
R21  1kΩ  [R0603 COPY - NO SILK]
R48  200Ω  [R0805]
R62  2.2kΩ  [R0805]
R65  330  [RES-TH_BD2.4-L6.3-P10.30-D0.6]
R66  200Ω  [R0805]
R104  2kΩ  [R0603 COPY - NO SILK]
SJ3  JUMPER-PAD-3-NO  [3_SOLDER_JUMPER_LG]
SW_REMOTE  Remote  [SW-SMD_4P-L5.1-W5.1-P3.70-LS6.5-TL-2]
SW_STEER  Steer  [SW-SMD_4P-L5.1-W5.1-P3.70-LS6.5-TL-2]
SW_WORK  Work  [SW-SMD_4P-L5.1-W5.1-P3.70-LS6.5-TL-2]
sheet JUMPERS
H2  P11-A12  [HDR-TH_2P-P2.54-V-M-1]
H3  Ground  [HDR-TH_6P-P2.54-V-M-1]
H5  P12-A13  [HDR-TH_2P-P2.54-V-M-1]
H15  P13-A14  [HDR-TH_2P-P2.54-V-M-1]
H16  Remote/Pressure  [HDR-TH_3P-P2.54-V-M]
U22  Remote/Pressure  [JUMPER3]
sheet MAIN
AS-ACT  DY-339URUYGW/SN  [LED-TH_3P-BD5.0-P2.54]
C1  1000uF  [CAP-TH_BD13.0-P5.00-D1.2-FD]
C2  100uF  [CASE-B_3528]
C4  100uF  [CASE-B_3528]
C15  1000uF  [CAP-TH_BD13.0-P5.00-D1.2-FD]
C23  100uF  [CASE-B_3528]
C26  100nF  [C0603]
CN2  HEADER_ethernet-2X3P  [HDR-TH_6P-P2.00-V-F-R2-C3-S2.00]
D4  SM4007PL  [SOD-123F_L2.8-W1.8-LS3.7-RD]
D6  SS54_C22452  [SMA_L4.4-W2.8-LS5.4-R-RD]
D7  SM4007PL  [SOD-123F_L2.8-W1.8-LS3.7-RD]
D12  1N5401  [DO-201_BD5.3-L9.5-P13.50-D1.4-RD]
D14  1N5819WS  [SOD-323_L1.8-W1.3-LS2.5-RD COPY - NO SILK]
D41  1N5819WS  [SOD-323_L1.8-W1.3-LS2.5-RD COPY - NO SILK]
GPS/RTK  DY-339URUYGW/SN  [LED-TH_3P-BD5.0-P2.54]
H21  VUSB  [HDR-TH_2P-P2.54-V-F]
LED4  5V2  [LED0805-R-RD]
LED5  5V1  [LED0805-R-RD]
LED7  5V_WAS  [LED0805-R-RD]
LED18  INVERTED 12V!  [LED0805-RD]
PWR/ETH  DY-339URUYGW/SN  [LED-TH_3P-BD5.0-P2.54]
R4  1kΩ  [R0603 COPY - NO SILK]
R9  5.1kΩ  [R0603]
R11  5.1kΩ  [R0603]
R17  5.1kΩ  [R0603]
R32  330Ω  [R0603]
R33  330Ω  [R0603]
R34  330Ω  [R0603]
R35  330Ω  [R0603]
R36  330Ω  [R0603]
R37  330Ω  [R0603]
R106  1kΩ  [R0603 COPY - NO SILK]
RJ1  HR913550A  [RJ45-TH_HR913550A]
U4  GNSS power  [PWRM-TH_K7805M-1000R3]
U5  Teensy/IMU Power  [PWRM-TH_K7805M-1000R3]
U6  MC7805CTG  [TO-220-3_L10.0-W4.5-P2.54-T]
U7  Header_20pin  [HDR-TH_20P-P2.54-V-F_1.02MM]
U8  Header_20pin  [HDR-TH_20P-P2.54-V-F_1.02MM]
U9  HEADER_TEENSY  [HDR-TH_4P-P2.54-V-F]
U10  HEADER_TEENSY  [HDR-TH_24P-P2.54-V-F]
U11  HEADER_TEENSY  [HDR-TH_24P-P2.54-V-F]
U12  Teensy4.1 ETH only  [TEENSY4.1 ETH ONLY]
U902  HEADER_TEENSYY  [HDR-TH_4P-P2.54-V-F]
sheet SENSORS
C3  100nF  [C0603]
C19  100nF  [C0603]
C20  1nF  [C0603]
D13  1N5819WS  [SOD-323_L1.8-W1.3-LS2.5-RD]
D19  1N5819WS  [SOD-323_L1.8-W1.3-LS2.5-RD]
H4  4-20ma  [HDR-TH_2P-P2.54-V-M-1]
R6  6.2kΩ  [R0603 COPY - NO SILK]
R7  200Ω  [R0805]
R55  12kΩ  [R0603 COPY - NO SILK]
U1  ACS712ELCTR-05B-T  [SOIC-8_L5.0-W4.0-P1.27-LS6.0-BL]
sheet STEERING
CN1  CYTRON CABLE  [CONN-TH_SEEED-110990030]
D8  SS54_C22452  [SMA_L4.4-W2.8-LS5.4-R-RD]
H8  HEADER_3PIN  [HDR-TH_3P-P2.54-V-F]
H22  Danfoss Us  [HDR-TH_2P-P2.54-V-M-1]
J3  HEADER_Cytron 2x8  [HDR-TH_16P-P2.54-V-F-R2-C8-S2.54-1]
Q3  D882_C9634  [SOT-89-3_L4.5-W2.5-P1.50-LS4.2-BR]
Q9  IRF5305PBF  [TO-220-3_L10.0-W4.5-P2.54-T]
R5  1kΩ  [R0603 COPY - NO SILK]
R10  1kΩ  [R1206]
R23  1kΩ  [R0603 COPY - NO SILK]
R24  1kΩ  [R0603 COPY - NO SILK]
R25  1kΩ  [R0603 COPY - NO SILK]
R47  10kΩ  [R1206]
U2  Cytron MD13S  [CYTRON MD13S]
U3  TC4427AEOA713  [SOIC-8_L4.9-W3.9-P1.27-LS6.0-BL]
U13  HEAT_SINK  [SINK-TH_L15.0-W10.5-H21.0]
sheet WAS
C16  100nF  [C0603]
C30  10nF  [C0805]
C31  10nF  [C0805]
D2  1N5819WS  [SOD-323_L1.8-W1.3-LS2.5-RD]
D22  1N5819WS  [SOD-323_L1.8-W1.3-LS2.5-RD]
H9  HEADER_ADS-MCP6002  [HDR-F-2.54_1X10]
H10  22850102ANG1SYA02  [HDR-TH_2P-P2.54-V-F]
JP1  A0  [2_SOLDER_JUMPER_LG]
P4  ADS1115  [ADS1115 BREAKOUT BOARD]
Q4  2N7002  [SOT-23-3_L2.9-W1.3-P1.90-LS2.4-BR]
Q5  2N7002  [SOT-23-3_L2.9-W1.3-P1.90-LS2.4-BR]
R22  5.1kΩ  [R0603]
R53  1.5kΩ  [R0603]
R56  1.5kΩ  [R0603]
R63  5.1kΩ  [R0603]
U20  ADS1115IDGSR  [MSOP-10_L3.0-W3.0-P0.50-LS5.0-BL]

## Library data of the parts
C3 C11 C16 C17 C19 C26 = CC0603KRX7R9BB104: Supplier: LCSC; Manufacturer: YAGEO; Supplier Part: C14663; JLCPCB Part Class: Basic Part
D5 = PESD1CAN,215: Supplier: LCSC; Manufacturer: Nexperia; image: //image.lceda.cn/szlcsc/C15771.jpg; Supplier Part: C15771; SMT Type: Extend; JLCPCB SMD: Yes; Paste Type: expand
JP2 JP6-JP9 = SPARKFUN-JUMPERS_JUMPER-SMT_2_NC_PASTE_NO-SILK: Contributor: raskol; Supplier: opencircuit
R18 R64 = 0805W8F1200T5E: Supplier: LCSC; Manufacturer: UniOhm; Supplier Part: C17437; Resistance (Ohms): 120; JLCPCB Part Class: Basic Part
U17 = MCP2562-E/SN: Supplier: LCSC; Manufacturer: MICROCHIP; Supplier Part: C53609; JLCPCB Part Class: Extended Part
J2 = AMPSEAL 23 - 776087-1: Contributor: aKKoufen; Link: https://fr.rs-online.com/web/p/embases-circuits-imprimes/7181471; Code RS: 718-1471; Ref Fabricant: 776087-1; Marque: TE Connectivity; Supplier Part: C378893
K1 = DT13-12PA: Manufacturer: DEUTSCH DT; link: https://www.te.com/usa-en/product-DT13-12PA.html?fbclid=IwAR39tNBAoYJf2IA76Wg8xnUmEBiRwHUhbK_2fx16O6vP97envFwLxjVRyOc; Contributor: razzer_n
B/U_LED1-B/U_LED3 = 19-213/Y2C-CQ2R2L/3T(CY)-YELLOW: Supplier: LCSC; Manufacturer: EVERLIGHT(亿光); Manufacturer Part: 19-213/Y2C-CQ2R2L/3T(CY); Supplier Part: C72038; JLCPCB Part Class: Basic Part
C2 C4 C5 C23 = TAJB107K006RNJ: Supplier: LCSC; Manufacturer: Kyocera AVX; Supplier Part: C16133; JLCPCB Part Class: Basic Part
C14 = 22uF 16V 4*7: Supplier: LCSC; Manufacturer: ValuePro; Supplier Part: C43845; JLCPCB Part Class: Extended Part
GPS_UM982EB = UM982EB-NO-PADS: Manufacturer: Unicore Communications; Manufacturer Part: UM982 Evaluation Board; Supplier: ArduSimple; Contributor: Matt Elias
H1 = Header-Male-2.54_1x3: Supplier: LCSC; Manufacturer: BOOMELE; Manufacturer Part: Header2.54mm 1*3P; Supplier Part: C49257; JLCPCB Part Class: Extended Part
H6 H7 = PM254-1-10-Z-8.5: Supplier: LCSC; Supplier Part: C2897373; Manufacturer: HCTL(华灿天禄); Contributor: LCSC; JLCPCB Part Class: Extended Part
H12 H16 H17 H23 H25 = PZ254V-11-03P_C2937625: Contributor: LCSC; Supplier: LCSC; Supplier Part: C2937625; Manufacturer: XFCN(兴飞); Manufacturer Part: PZ254V-11-03P; JLCPCB Part Class: Extended Part; link: https://lcsc.com/eda_search?q=C2937625&%26type=1&ref=editor
H13 H14 H18 H19 = PM254-1-06-Z-8.5: Supplier: LCSC; Supplier Part: C2897369; Manufacturer: HCTL(华灿天禄); Contributor: LCSC; JLCPCB Part Class: Extended Part
H20 = 2263-214SG0DYNT5 - wide: Contributor: Matt Elias; Supplier: LCSC; Supplier Part: C721809; Manufacturer: Wcon(维峰电子); Manufacturer Part: 2263-214SG0DYNT5; JLCPCB Part Class: Extended Part
H24_LEDS = XDM254-1-04-Z-8.5-G0: Supplier: LCSC; Supplier Part: C19268697; Manufacturer: XUNDA(讯答); Contributor: lcsc
LED1-LED3 = LTL-307G: Supplier: LCSC; Supplier Part: C125080; Manufacturer: Lite-On; Contributor: LCSC; JLCPCB Part Class: Extended Part
LED4 LED5 LED7 LED8 = 0805G (Green): Supplier: LCSC; Manufacturer: KENTO; Manufacturer Part: KT-0805翠绿; Supplier Part: C2297; JLCPCB Part Class: Basic Part
P1 = KF2510-3A: Supplier Part: E29275; Supplier: EasyEDA
P2 P3 = UNO_R3: sourceId: 1T5FDZYC8
P5-P8 = Header-Female-2.54_1x8: Supplier: LCSC; Manufacturer: BOOMELE(博穆精密); Manufacturer Part: 2.54-1*8P母环保; Supplier Part: C27438; JLCPCB Part Class: Extended Part
R8 R29 R31 = RD 1/2WS 1K J T/B A1: Supplier: LCSC; Supplier Part: C433798; Manufacturer: TyoHM; Contributor: LCSC
R20 = 0603WAF3001T5E: Supplier: LCSC; Manufacturer: UNI-ROYAL(厚声); Supplier Part: C4211; JLCPCB Part Class: Basic Part
R26-R28 R30 R38 R59 = 0402WGF1001TCE: Supplier: LCSC; Manufacturer: UNI-ROYAL(厚声); Supplier Part: C11702; JLCPCB Part Class: Basic Part
SJ1-SJ3 = JUMPER-PAD-3-NO: Contributor: Matt Elias
SJ_LED2 SJ_LED3 = JUMPER-PAD-3-2OF3_NC_BY_TRACE_SMALL: Contributor: Matt Elias
U14 = 1.27-1*8P母: Contributor: LCSC; Supplier: LCSC; Supplier Part: C691120; Manufacturer: BOOMELE(博穆精密); JLCPCB Part Class: Extended Part; link: https://lcsc.com/eda_search?q=C691120&%26type=1&ref=editor
U16 = MP1584EN: Contributor: babeinlovexd
U900 = Bynav_minimal: Contributor: GoRoNb
JP1 JP3-JP5 = (JONGJIN)JUMPER_PAD_2P: Jumper 2 Pin; Contributor: PatternAgents
R12 R13 R19 R62 = 0805W8F2201T5E: Supplier: LCSC; Manufacturer: UniOhm; Supplier Part: C17520; Resistance (Ohms): 2.2K; JLCPCB Part Class: Basic Part
U15 = Ardfruit BNO085: Manufacturer: Ardfruit; Contributor: THume
D1 D3 D4 D7 D9 D11 = SM4007PL: Supplier: LCSC; Manufacturer: MDD; Supplier Part: C64898; JLCPCB Part Class: Basic Part; link: https://lcsc.com/eda_search?q=C64898&%26type=1&ref=editor
D15 = 1N4004: Supplier: LCSC; Manufacturer: MDD; image: //image.lceda.cn/szlcsc/C3058.jpg; Supplier Part: C3058; LCSC Assembly: Yes; SMT Type: Extend
H11 H22 = 68000-102HLF: Supplier: LCSC; Supplier Part: C2905434; Contributor: LCSC; JLCPCB Part Class: Extended Part
LED12 = 19-213/Y2C-CQ2R2L/3T(CY): Supplier: LCSC; Manufacturer: EVERLIGHT(亿光); Supplier Part: C72038; JLCPCB Part Class: Basic Part
LED_REMOTE LED_STEER LED_WORK = 0603WHITE LIGHT_C2290-WHITE: Supplier: LCSC; Manufacturer: null; Manufacturer Part: KT-0603白灯; Supplier Part: C2290; JLCPCB Part Class: Basic Part
OPTO_REMOTE OPTO_SPEEDPULSE OPTO_STEER OPTO_WORK = EL3H7(B)(TA)-G: Supplier: LCSC; Manufacturer: EVERLIGHT(亿光); Supplier Part: C32565; JLCPCB Part Class: Basic Part
Q1 Q3 = D882_C9634: Supplier: LCSC; Manufacturer: CJ(江苏长电/长晶); Manufacturer Part: D882 Y档160~320; Supplier Part: C9634; JLCPCB Part Class: Basic Part; link: https://lcsc.com/eda_search?q=C9634&%26type=1&ref=editor
R1 R4 R5 R14 R15 R21 R23-R25 R106 = 0603WAF1001T5E: Supplier: LCSC; Manufacturer: UNI-ROYAL(厚声); Supplier Part: C21190; JLCPCB Part Class: Basic Part; link: https://lcsc.com/eda_search?q=C21190&%26type=1&ref=editor
R2 R3 R16 = 0603WAF2700T5E: Supplier: LCSC; Manufacturer: UNI-ROYAL(厚声); Supplier Part: C22966; Resistance (Ohms): 270; JLCPCB Part Class: Basic Part
R7 R48 R66 = 0805W8F2000T5E: Supplier: LCSC; Manufacturer: UNI-ROYAL(厚声); Supplier Part: C17540; Resistance (Ohms): 200; JLCPCB Part Class: Basic Part
R65 = RD 1/2WS 1K J T/B A1: Supplier: LCSC; Manufacturer: TyoHM; Contributor: LCSC
R104 = 0603WAF2001T5E: Supplier: LCSC; Manufacturer: UNI-ROYAL(厚声); Supplier Part: C22975; JLCPCB Part Class: Basic Part; link: https://lcsc.com/eda_search?q=C22975&%26type=1&ref=editor
SW_REMOTE SW_STEER SW_WORK = TS-1187A-B-A-B: Contributor: LCSC; Supplier: LCSC; Supplier Part: C318884; Manufacturer: XKB Connectivity(中国星坤); JLCPCB Part Class: Basic Part; link: https://lcsc.com/eda_search?q=C318884&%26type=1&ref=editor
H2 H4 H5 H15 = Header-Male-2.54_1x2: Supplier: LCSC; Supplier Part: C2905434; JLCPCB Part Class: Extended Part
H3 = Header-Male-2.54_1x6: Supplier: LCSC; Manufacturer: BOOMELE; Supplier Part: C37208; JLCPCB Part Class: Extended Part
U22 = JUMPER3: Contributor: jeen
AS-ACT GPS/RTK PWR/ETH = DY-339URUYGW/SN: Supplier: LCSC; Supplier Part: C459134; Manufacturer: TONYU; Contributor: LCSC; JLCPCB Part Class: Extended Part
C1 C15 = 35YXJ1000M12.5X20: Supplier: LCSC; Manufacturer: rubycon(红宝石); Supplier Part: C88743; JLCPCB Part Class: Extended Part
CN2 = PM200-2-03-Z-4.3: Contributor: LCSC; Supplier: LCSC; Supplier Part: C2906071; Manufacturer: HCTL(华灿天禄); JLCPCB Part Class: Extended Part
D6 D8 = SS54_C22452: Supplier: LCSC; Manufacturer Part: SS54; Manufacturer: MDD; Supplier Part: C22452; JLCPCB Part Class: Basic Part
D12 = 1N5401: Supplier: LCSC; Manufacturer: MDD; image: //image.lceda.cn/szlcsc/C2459.jpg; Supplier Part: C2459; LCSC Assembly: Yes; SMT Type: Extend
D2 D13 D14 D19 D22 D41 = 1N5819WS: Contributor: LCSC; Supplier: LCSC; Supplier Part: C191023; Manufacturer: Hottech(合科泰); JLCPCB Part Class: Basic Part; link: https://lcsc.com/eda_search?q=C191023&%26type=1&ref=editor
H21 = ZX-PM2.54-1-2PY: Supplier: LCSC; Supplier Part: C7499322; Manufacturer: Megastar(兆星); Contributor: lcsc; JLCPCB Part Class: Extended Part
LED18 = FC-2012HRK-620D: Supplier: LCSC; Manufacturer: 国星光电; Manufacturer Part: NCD0805R1; Supplier Part: C84256; JLCPCB Part Class: Basic Part
R9 R11 R17 R22 R63 = 0603WAF5101T5E: Supplier: LCSC; Manufacturer: UniOhm; Supplier Part: C23186; Resistance (Ohms): 5.1K; JLCPCB Part Class: Basic Part
R32-R37 = 0603WAF3300T5E: Supplier: LCSC; Manufacturer: UniOhm; Supplier Part: C23138; Resistance (Ohms): 330; JLCPCB Part Class: Basic Part
RJ1 = HR913550A: Supplier: LCSC; Manufacturer: HANRUN; Contributor: LCSC; Supplier Part: C163507; JLCPCB Part Class: Extended Part
U4 U5 = K7805M-1000R3: Supplier: LCSC; Manufacturer: MORNSUN; Contributor: LCSC; Supplier Part: C132362; JLCPCB Part Class: Extended Part
U6 = MC7805CTG: Supplier: LCSC; Manufacturer: ON; Supplier Part: C22456; JLCPCB Part Class: Extended Part; Package Display: No
U7 U8 = Header-Female-2.54_1x20: Supplier: LCSC; Manufacturer: BOOMELE; Manufacturer Part: 2.54mm 1*20P Female header; Supplier Part: C50984; JLCPCB Part Class: Extended Part
U9 U902 = FH-00133: Supplier: LCSC; Supplier Part: C2685089; Manufacturer: Liansheng(连盛); Contributor: LCSC; JLCPCB Part Class: Extended Part
U10 U11 = X6511FV-24-C85D32: Supplier: LCSC; Supplier Part: C2883741; Manufacturer: XKB Connectivity(中国星坤); Contributor: LCSC; JLCPCB Part Class: Extended Part
U12 = Teensy4.1 ETH only: Manufacturer: PJRC; Manufacturer Part: Teensy4.1; link: https://www.pjrc.com/store/teensy41.html; Contributor: Synchrotron
C20 = CL10B102KB8NNNC: Supplier: LCSC; Manufacturer: SAMSUNG; Supplier Part: C1588; JLCPCB Part Class: Basic Part
R6 = 0603WAF6201T5E: Supplier: LCSC; Manufacturer: UNI-ROYAL(厚声); Supplier Part: C4260; JLCPCB Part Class: Basic Part; link: https://lcsc.com/eda_search?q=C4260&%26type=1&ref=editor
R55 = 0603WAF1202T5E: Supplier: LCSC; Manufacturer: UNI-ROYAL(厚声); Supplier Part: C22790; JLCPCB Part Class: Basic Part; link: https://lcsc.com/eda_search?q=C22790&%26type=1&ref=editor
U1 = ACS712ELCTR-05B-T: Supplier: LCSC; Manufacturer: ALLEGRO(美国埃戈罗); Supplier Part: C44471; JLCPCB Part Class: Extended Part
CN1 = SEEED-110990030: Supplier: LCSC; Supplier Part: C403774; Manufacturer: Seeed(矽递科技); Contributor: LCSC; JLCPCB Part Class: Extended Part
H8 = FFH25405-S03S1001K6K: Supplier: LCSC; Supplier Part: C146243; Contributor: LCSC; JLCPCB Part Class: Extended Part
J3 = Header-Female-2.54_2x8: Supplier: LCSC; Manufacturer: BOOMELE(博穆精密); Manufacturer Part: 2.54-2*8P母; Supplier Part: C30734; JLCPCB Part Class: Extended Part
Q9 = IRF5305PBF: Supplier: LCSC; Manufacturer: Infineon(英飞凌); Supplier Part: C2623; JLCPCB Part Class: Extended Part
R10 = 1206W4F1001T5E: Supplier: LCSC; Manufacturer: UniOhm; Supplier Part: C4410; Resistance (Ohms): 1K; JLCPCB Part Class: Basic Part
R47 = 1206W4F1002T5E: Supplier: LCSC; Manufacturer: UniOhm; Supplier Part: C17902; Resistance (Ohms): 10K; JLCPCB Part Class: Basic Part
U2 = Cytron MD13S: Contributor: THume
U3 = TC4427AEOA713: Supplier: LCSC; Manufacturer: MICROCHIP(美国微芯); Contributor: LCSC; Supplier Part: C20551; JLCPCB Part Class: Extended Part
U13 = 15*10.5*21: Supplier: LCSC; Supplier Part: C4649; Manufacturer: Made in China; Contributor: LCSC; JLCPCB Part Class: Extended Part
C30 C31 = CL21B103KBANNNC: Supplier: LCSC; Manufacturer: SAMSUNG; Supplier Part: C1710; JLCPCB Part Class: Basic Part
H9 = HDR-F-2.54_1x10: Supplier Part: C2897373; Supplier: LCSC; Contributor: LCEDA_Lib
H10 = 22850102ANG1SYA02: Supplier: LCSC; Supplier Part: C429966; Manufacturer: JILN(锦凌); Contributor: LCSC; JLCPCB Part Class: Extended Part
P4 = ADS1115: sourceId: 1T5FDZYC8; Package Display: No
Q4 Q5 = 2N7002: Supplier: LCSC; Manufacturer: CJ; Supplier Part: C8545; JLCPCB Part Class: Basic Part
R53 R56 = 0603WAF1501T5E: Supplier: LCSC; Manufacturer: UniOhm; Supplier Part: C22843; Resistance (Ohms): 1.5K; JLCPCB Part Class: Basic Part
U20 = ADS1115IDGSR: Supplier: LCSC; Manufacturer: TI; Supplier Part: C37593; JLCPCB Part Class: Extended Part

## Nets
3.3V: C17.2 D13.1(K) H10.1 H19.1 JP4.1 P2.26(IOREF) P3.26(IOREF) P6.7 P7.7 Q4.1(G) Q5.1(G) R1.1 R4.1 R12.1 R13.1 R14.1 R15.1 U7.15 U11.15 U12.15(3V3) U15.1(Vin) U17.5(VIO)
5V1: C23.1 H12.1 JP9.2 P1.1 P2.29(5V) P3.29(5V) P6.4 P7.4 R9.2 U4.3(+VO) U16.1(VIN)
5V2: C2.1 C11.2 D14.2(A) R2.2 R3.2 R16.2 R17.2 R48.1 R62.1 R104.1 U5.3(+VO) U17.3(VDD)
5v2: C19.2 U1.8(VCC)
5v_WAS: C4.1 C16.1 D2.1(K) D22.1(K) H9.1 J2.1 K1.1 LED7.1(A) P4.1(VDD) R22.1 R63.1 U6.3(Output) U20.8(VDD)
12v_Cytron: J3.1 J3.2 J3.3 J3.4 U1.1(IP+) U1.2(IP+) U2.4(+12/24)
+12v_board: C1.1 C15.1 D6.2(K) D7.1(C) D12.1(C) J2.20 K1.7 Q9.3(S) R19.1 R47.2 U4.1(VIN) U5.1(VIN) U6.1(Input)
+12v_in: D4.1(C) D6.1(A) D12.2(A) J2.22 K1.11
GND: AS-ACT.2(-) B/U_LED1.1(C) B/U_LED2.1(C) B/U_LED3.1(C) C1.2 C2.2 C3.1 C4.2 C5.2 C11.1 C14.2 C15.2 C16.2 C17.1 C19.1 C20.2 C23.2 C26.1 C30.1 C31.2 CN1.4 CN2.4 D5.3 D7.2(A) D8.1(A) D19.2(A) GPS/RTK.2(-) H3.1 H3.2 H3.3 H3.4 H3.5 H3.6 H6.7 H7.7 H8.3 H9.2 H11.2 H17.3 H19.3 H20.14 H20.17 H20.20 H20.22 H24_LEDS.4 H25.3 J2.4 J2.21 J2.23 J3.5 J3.6 J3.7 J3.8 JP5.1 JP6.1 K1.3 K1.10 K1.12 LED4.2(K) LED5.2(K) LED8.2(K) LED18.2(+) OPTO_REMOTE.3(EM) OPTO_STEER.3(EM) OPTO_WORK.3(EM) P2.7(GND) P3.7(GND) P4.2(GND) PWR/ETH.2(-) Q1.3(E) Q3.3(E) R7.1 R11.1 R55.1 RJ1.8(GND) RJ1.10 RJ1.11 RJ1.13 RJ1.14 SW_REMOTE.3(C) SW_REMOTE.4(D) SW_STEER.3(C) SW_STEER.4(D) SW_WORK.3(C) SW_WORK.4(D) U1.5(GND) U2.3(GND) U2.5(GND) U3.3(GND) U4.2(GND) U5.2(GND) U6.2(Ground) U7.1 U8.2 U8.15 U10.2 U10.15 U11.1 U12.1(GND) U12.34(GND) U12.47(GND) U12.64(GND) U15.3(GND) U16.2(GND) U16.4(GND) U17.2(VSS) U17.8(STBY) U20.3(GND) U900.14(GND) U900.17(GND) U900.20(GND) U900.22(GND)
Gnd: H12.2 P1.2 P2.30(GND) P2.31(GND) P3.30(GND) P3.31(GND) P6.2 P6.3 P7.2 P7.3
A0: JP1.2 U8.13 U10.13 U12.36(14_PWM_A0_TX3_SPDIF>)
A7-RX5: SJ1.1 U8.6 U10.6 U12.43(21_A7_RX5_BCLK1)
A10: C3.2 D13.2(A) D19.1(K) R6.1 R55.2 U7.16 U11.16 U12.16(24_PWM_A10_TX6_SCL2)
A12: H2.1 U7.18 U11.18 U12.18(26_A12_MOSI1)
A12B: H2.2 J2.11
A13: H5.1 U7.19 U11.19 U12.19(27_A13_SCK1)
A13B: H5.2 J2.12
A14: H15.1 U8.19 U10.19 U12.30(38_DAT3)
A14B: H15.2 J2.13
A15: U8.18 U10.18 U12.31(39_DAT2)
A16: U8.17 U10.17 U12.32(40_A16_CS1)
A17: U1.7(VIOUT) U8.16 U10.16 U12.33(41_A17_MIS01)
AS_ACT: R34.2 U7.14 U11.14 U12.14(12_PWM_MISO_MQSL)
AS_STB: R35.2 U7.13 U11.13 U12.13(11_PWM_MOSI_CTX1)
BNO-SDA: H19.5 R13.2 SJ1.2 SJ1.3 U8.9 U10.9 U12.40(18_PWM_A4_SDA0) U15.5(SDA)
By-ANT1: H20.7 SJ_LED2.1 U900.7(Ant1//)
By-ANT2: H20.10 SJ_LED3.1 U900.10(Ant2/CANRX//)
Bynav/UM982: C5.1 C14.1 H20.6 JP9.1 R20.1 U16.3(VOUT) U900.6(VCC_3V3)
CanH1: D5.2 J2.16 R64.2 U17.7(CANH)
CanL1: D5.1 J2.17 JP2.2 U17.6(CANL)
CANRX1: U11.22 U12.22(30_CRX3) U17.4(RXD) U902.2
CANTX1: U11.23 U12.23(31_CTX3) U17.1(TXD) U902.3
CYTRON_AUX: J2.18 U1.3(IP-) U1.4(IP-)
DIFF: U900.21(SCLK//)
DIR: R5.1 U7.6 U11.6 U12.6(4_PWM_BCLK2)
ERR_STAT: H20.26 SJ_LED3.3
ETHERNET: R36.2 U7.8 U11.8 U12.8(6_PWM_OUT1D)
FREEWHEELMOD: CN1.3 R25.1
GPSFIX: R33.2 U7.11 U11.11 U12.11(9_PWM_OUT1C)
L2: R8.2 R26.1 R38.1 SJ_LED2.2
L3: R27.1 R28.1 R29.2 SJ_LED3.2
LEFT: H22.2 J2.5 J3.9 J3.10 J3.11 J3.12 K1.5 U2.6(MA)
LOCK: D8.2(K) J2.7 K1.6 Q9.2(D) U3.6(VDD)
POWERON: R37.2 U7.7 U11.7 U12.7(5_PWM_IN2)
Pres/Rem: H16.2 J2.10 K1.8 U22.2
PressureSense: H4.1 H16.3 R6.2 U22.3
PVT_STAT/DIFF: H20.21 R30.1 R31.2 R59.1
PWM1: R23.1 U3.2(IN A) U7.4 U11.4 U12.4(2_PWM_OUT2)
PWM2: R24.1 R25.2 U7.5 U11.5 U12.5(3_PWM_LRCLK2)
R+: CN2.1 RJ1.3 U12.60(R+)
R-: CN2.2 RJ1.6 U12.65(R-)
RemotePin: D9.1(C) H16.1 U22.1
RemoteSw: LED_REMOTE.2(K) OPTO_REMOTE.4(COL) U8.20 U10.20 U12.29(37_PWM_CMD_SCK2)
RIGHT: J2.6 J3.13 J3.14 J3.15 J3.16 K1.4 U2.7(MB)
RTK_STAT: H20.25 SJ_LED2.3
RTKFIX: R32.2 U7.12 U11.12 U12.12(10_PWM_CS_MQSR)
RX1: H20.15 P2.11(D0) P5.1 U7.20 U11.20 U12.20(28_PWM_RX7) U900.15(TxD1)
RX2: P3.11(D0) P8.1 U7.9 U11.9 U12.9(7_PWM_RX2_OUT1A)
RX3: H1.2 H1.3 H12.3 P1.3 SJ2.1 SJ2.2 U8.12 U10.12 U12.37(15_PWM_A1_RX3_SPDIF<)
SCL0: H19.4 JP3.1 JP3.2 R12.2 U8.8 U10.8 U12.41(19_PWM_A5_SCL0) U15.4(SCL)
SCL_HV: H9.3 P4.3(SCL) Q4.3(D) R63.2 U20.10(SCL)
SCL_LV: Q4.2(S) U8.11 U10.11 U12.38(16_A2_RX4_SCL1)
SDA_HV: H9.4 P4.4(SDA) Q5.3(D) R22.2 U20.9(SDA)
SDA_LV: Q5.2(S) U8.10 U10.10 U12.39(17_A3_TX4_SDA1)
SPEED+: H23.2 J2.14 JP7.1 JP8.1 R65.2 R66.1 SJ3.2
SPEED-: D3.1(C) D15.2(K) H11.1 J2.15 JP5.2 JP6.2
Speedpulse: R21.1 U9.1 U10.21 U12.28(36_PWM_CLK_CS2)
SteerPin: D1.1(C) J2.8 K1.9
SteerSw: LED_STEER.2(K) OPTO_STEER.4(COL) U11.24 U12.24(32_OUT1B) U902.4
T+: CN2.6 RJ1.1 U12.63(T+)
T-: CN2.5 RJ1.2 U12.62(T-)
T_VUSB: D41.2(A) H21.1
TX1: H20.16 P2.12(D1) P5.2 U11.21 U12.21(29_PWM_TX7) U900.16(RxD1) U902.1
TX2: P3.12(D1) P8.2 U7.10 U11.10 U12.10(8_PWM_TX2_IN1)
TX2_F9p: H1.1 P2.13(D2) P5.3 SJ2.3
U-RX2: H20.19 H25.2
U-RX3: H17.2 H20.8
U-TX2: H20.18 H25.1
U-TX3: H17.1 H20.13
WAS_H: J2.2 K1.2 R53.2
WAS_H_2: C30.2 D22.2(A) H9.7 P4.7(A0) R53.1 U20.4(AIN0)
WAS_L: J2.3 R56.2
WAS_L_2: C31.1 D2.2(A) H9.8 P4.8(A1) R56.1 U20.5(AIN1)
WorkPin: D11.1(C) J2.9
WorkSw: U9.3 U10.23 U12.26(34_DAT1_MISO2)
WorkSW: LED_WORK.2(K) OPTO_WORK.4(COL)
Net-(AS-ACT-1): AS-ACT.1(+) R34.1
Net-(AS-ACT-3): AS-ACT.3(+) R35.1
Net-(B/U_LED1-2): B/U_LED1.2(A) R59.2
Net-(B/U_LED2-2): B/U_LED2.2(A) R26.2
Net-(B/U_LED3-2): B/U_LED3.2(A) R27.2
Net-(C20-1): C20.1 U1.6(FILTER)
Net-(C26-2): C26.2 RJ1.4 RJ1.5
Net-(CN1-1): CN1.1 H8.1 R5.2 U2.1(DIR)
Net-(CN1-2): CN1.2 H8.2 R23.2 U2.2(PWM)
Net-(CN2-3): CN2.3 RJ1.12 U12.61(LED)
Net-(D1-2): D1.2(A) OPTO_STEER.2(CAT) SW_STEER.1(A) SW_STEER.2(B)
Net-(D3-2): D3.2(A) D15.1(A) OPTO_SPEEDPULSE.3(EM)
Net-(D4-2): D4.2(A) R106.2
Net-(D9-2): D9.2(A) OPTO_REMOTE.2(CAT) SW_REMOTE.1(A) SW_REMOTE.2(B)
Net-(D11-2): D11.2(A) OPTO_WORK.2(CAT) SW_WORK.1(A) SW_WORK.2(B)
Net-(D14-1): D14.1(K) D41.1(K) U8.1 U10.1 U12.48(VIN)
Net-(GPS/RTK-1): GPS/RTK.1(+) R32.1
Net-(GPS/RTK-3): GPS/RTK.3(+) R33.1
Net-(H4-2): H4.2 R7.2
Net-(H6-1): H6.1 P2.1(D8) P3.13(D2) P8.3
Net-(H9-5): H9.5 P4.5(ADDR)
Net-(H9-6): H9.6 P4.6(ALRT)
Net-(H9-9): H9.9 P4.9(A2)
Net-(H9-10): H9.10 P4.10(A3)
Net-(H10-2): H10.2 JP1.1
Net-(H13-1): H13.1 P2.24(A5)
Net-(H13-2): H13.2 P2.23(A4)
Net-(H13-3): H13.3 P2.22(A3)
Net-(H13-4): H13.4 P2.21(A2)
Net-(H13-5): H13.5 P2.20(A1)
Net-(H13-6): H13.6 P2.19(A0)
Net-(H14-1): H14.1 P3.24(A5)
Net-(H14-2): H14.2 P3.23(A4)
Net-(H14-3): H14.3 P3.22(A3)
Net-(H14-4): H14.4 P3.21(A2)
Net-(H14-5): H14.5 P3.20(A1)
Net-(H14-6): H14.6 P3.19(A0)
Net-(H18-1): H18.1 U15.7(CS)
Net-(H18-2): H18.2 U15.8(DI)
Net-(H18-3): H18.3 U15.9(RST)
Net-(H18-4): H18.4 U15.10(P1)
Net-(H18-5): H18.5 JP4.2 U15.11(P0)
Net-(H18-6): H18.6 U15.12(BT)
Net-(H19-2): H19.2 U15.2(3v3)
Net-(H19-6): H19.6 U15.6(INT)
Net-(H22-1): H22.1 R10.2
Net-(H23-1): H23.1 JP7.2 R62.2 SJ3.1
Net-(H23-3): H23.3 JP8.2 R19.2 SJ3.3
Net-(H24_LEDS-1): H24_LEDS.1 R30.2 R31.1
Net-(H24_LEDS-2): H24_LEDS.2 R8.1 R38.2
Net-(H24_LEDS-3): H24_LEDS.3 R28.2 R29.1
Net-(JP2-1): JP2.1 R64.1
Net-(LED4-1): LED4.1(A) R17.1
Net-(LED5-1): LED5.1(A) R9.1
Net-(LED7-2): LED7.2(K) R11.2
Net-(LED8-1): LED8.1(A) R20.2
Net-(LED12-1): LED12.1(C) OPTO_SPEEDPULSE.2(CAT) Q1.2(C)
Net-(LED12-2): LED12.2(A) R104.2
Net-(LED18-1): LED18.1(-) R106.1
Net-(LED_REMOTE-1): LED_REMOTE.1(A) R1.2
Net-(LED_STEER-1): LED_STEER.1(A) R15.2
Net-(LED_WORK-1): LED_WORK.1(A) R14.2
Net-(OPTO_REMOTE-1): OPTO_REMOTE.1(AN) R3.1
Net-(OPTO_SPEEDPULSE-1): OPTO_SPEEDPULSE.1(AN) R48.2
Net-(OPTO_SPEEDPULSE-4): OPTO_SPEEDPULSE.4(COL) R18.2 R65.1
Net-(OPTO_STEER-1): OPTO_STEER.1(AN) R2.1
Net-(OPTO_WORK-1): OPTO_WORK.1(AN) R16.1
Net-(P2-14): P2.14(D3) P5.4
Net-(P2-15): P2.15(D4) P5.5
Net-(P2-16): P2.16(D5) P5.6
Net-(P2-17): P2.17(D6) P5.7
Net-(P2-18): P2.18(D7) P5.8
Net-(PWR/ETH-1): PWR/ETH.1(+) R36.1
Net-(PWR/ETH-3): PWR/ETH.3(+) R37.1
Net-(Q1-1): Q1.1(B) R21.2
Net-(Q3-1): Q3.1(B) R24.2
Net-(Q3-2): Q3.2(C) Q9.1(G) R47.1
Net-(R4-2): R4.2 RJ1.9
Net-(R10-1): R10.1 U3.7(OUT A#)
Net-(R18-1): R18.1 R66.2
Net-(U7-2): U7.2 U11.2 U12.2(0_PWM_RX1_CRX2_CS1)
Net-(U7-3): U7.3 U11.3 U12.3(1_PWM_TX1_CTX2_MISO1)
Net-(U7-17): U7.17 U11.17 U12.17(25_PWM_A11_RX6_SDA2)
Net-(U8-3): U8.3 U10.3 U12.46(3V3)
Net-(U8-4): U8.4 U10.4 U12.45(23_PWM_A9_CRX1_MCLK1)
Net-(U8-5): U8.5 U10.5 U12.44(22_PWM_A8_CTX1)
Net-(U8-7): U8.7 U10.7 U12.42(20_A6_TX5_LRCLK1)
Net-(U8-14): U8.14 U10.14 U12.35(13_PWM_SCK_CRX1_LED)
Net-(U9-2): U9.2 U10.22 U12.27(35_DAT0_MOSI2)
Net-(U9-4): U9.4 U10.24 U12.25(33_PWM_MCLK2)

Not connected (* = marked no-connect by the designer): H6 2* 3* 4* 5* 6* 8* 9* 10*; H7 1* 2* 3* 4* 5* 6* 8* 9* 10*; H20 1* 2* 3* 4* 5* 9* 11* 12* 23* 24* 27* 28*; H21 2*; J2 19* MH1* MH2*; LED1 1(-) 2(+); LED2 1(-) 2(+); LED3 1(-) 2(+); P2 2(D9)* 3(D10)* 4(D11)* 5(D12)* 6(D13)* 8(AREF)* 9(SDA)* 10(SCL)* 25(POWER)* 27(RESET)* 28(3V3)* 32(VIN)*; P3 1(D8)* 2(D9)* 3(D10)* 4(D11)* 5(D12)* 6(D13)* 8(AREF)* 9(SDA)* 10(SCL)* 14(D3)* 15(D4)* 16(D5)* 17(D6)* 18(D7)* 25(POWER)* 27(RESET)* 28(3V3)* 32(VIN)*; P6 1* 5* 6* 8*; P7 1* 5* 6* 8*; P8 4* 5* 6* 7* 8*; RJ1 7(NC)*; U3 1(NC)* 4(IN B)* 5(OUT B#)* 8(NC)*; U13 1*; U14 1* 2* 3* 4* 5* 6* 7* 8*; U20 1(ADDR)* 2(ALERT/RDY)* 6(AIN2)* 7(AIN3)*; U900 5(n.c.)* 8(MISO/RxD3)* 9(_Reset)* 11(CANTX//)* 12(CAN2RX)* 13(TxD3)* 18(TxD2//)* 19(RxD2//)* 23(PPS)* 24(CAN2TX//)* 25(TD+)* 26(RD+)* 27(TD-)* 28(RD-)*

## Notes on the sheets
sheet 1
- Matt
  - changed some transistors to similar part with available stock
  - added schottky diodes for WAS inputs
  - added jumpers for Speed pulse +/- outputs
  - tweaked Eth traces for equal length
  - edited amp23 footprint (doc layer) to accurately show area that needs to stay clear of parts
  - added 3V3 reg from Micro PCB for ByNav/UM982
  - fixed Bynav/UM982 TX/RX swap
- Power Input/Converters
- POWERON
- T_VUSB
sheet 2
- WAS Circuit
- for ADS - MCP6002 Teensy A/D board
sheet 3
- MOTOR/VALVE CONTROL
- PWM2
- Engage 6/2
sheet 5
- Option: Bynav-C1
- Option: UM982
sheet 6
- Input Switches
- only for
- the holes
- only for
- the holes
- Speedpulse Out
sheet 7
- Main Connectors, just pick the one you want
sheet 8
- Dual CANBUS
sheet 10
- PRESSURE/CURRENT CIRCUIT
